# EAGLE board Spartan3E_DevBoard-v22 (EAGLE 5.00)
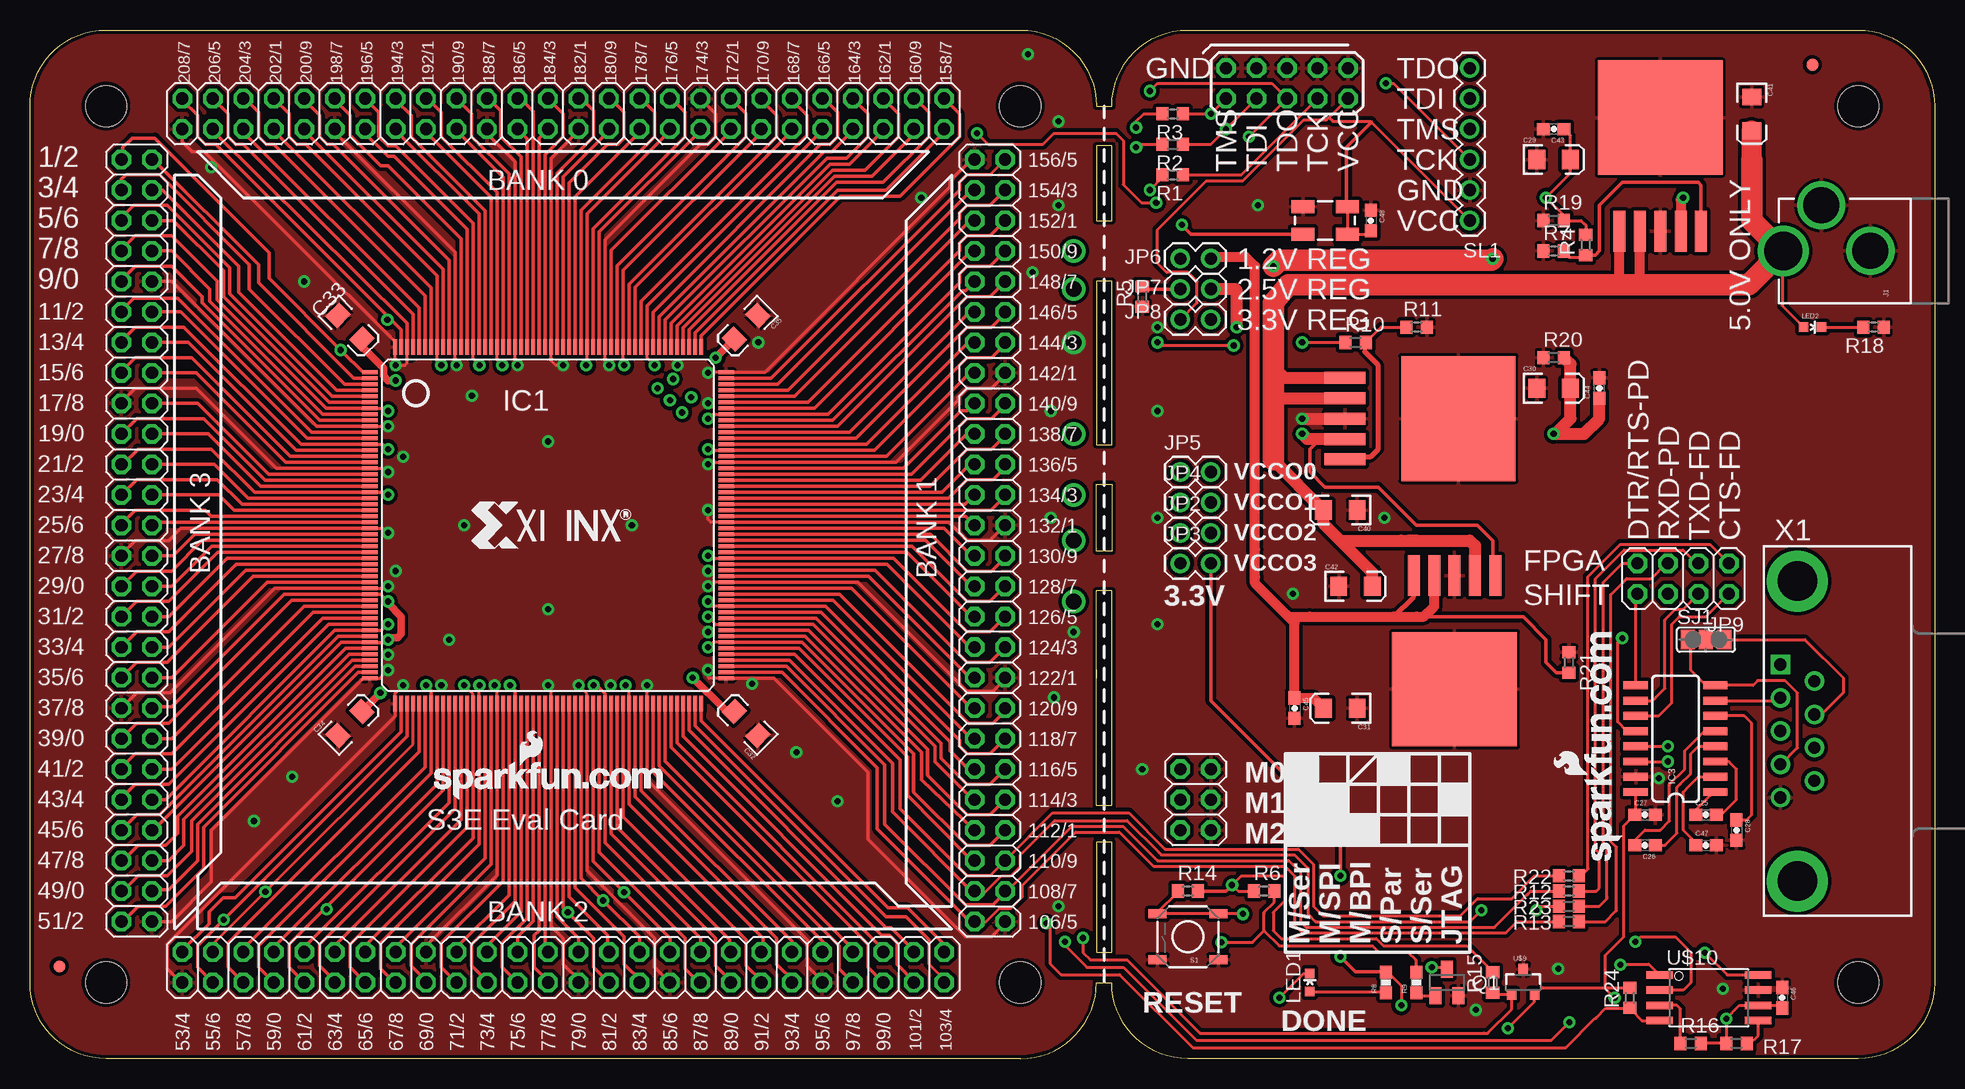
[diagram p3: board, top side]
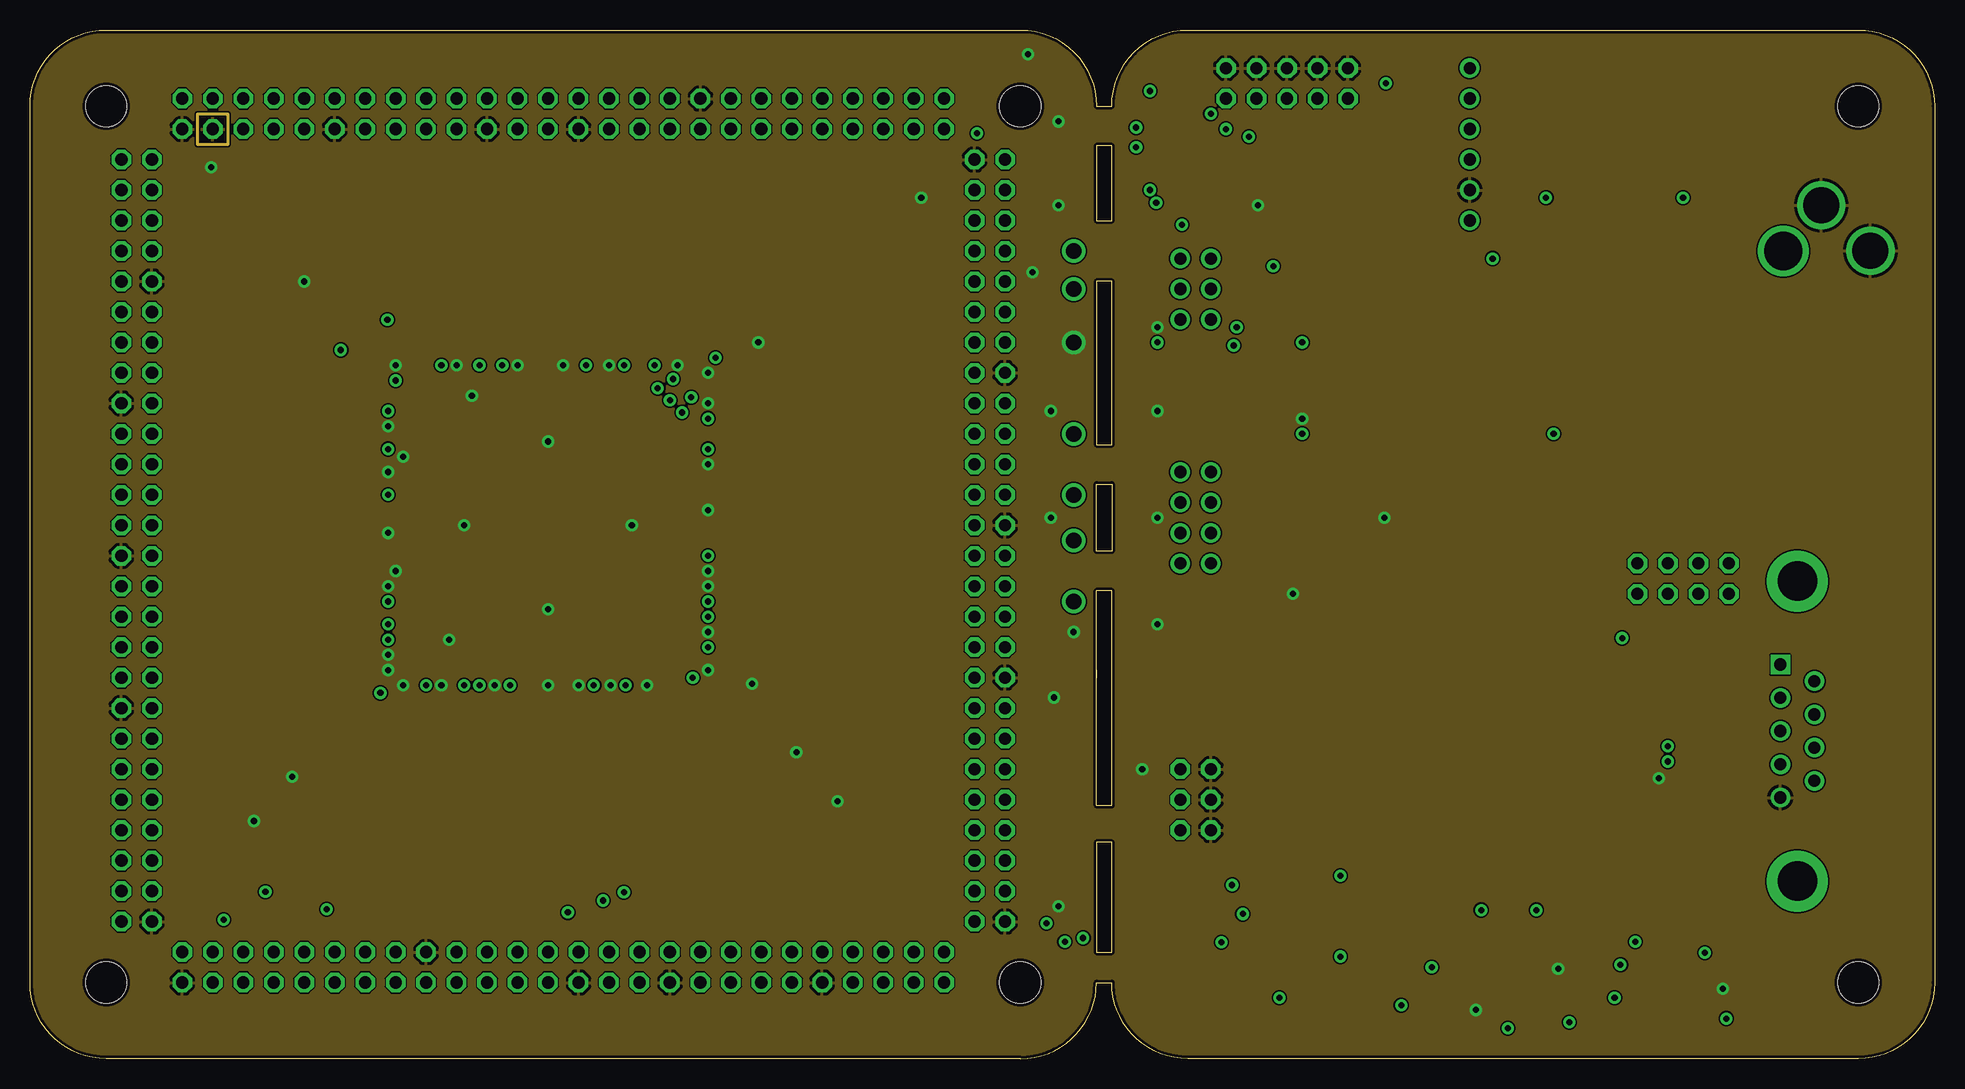
[diagram p4: board, inner layer Route2]
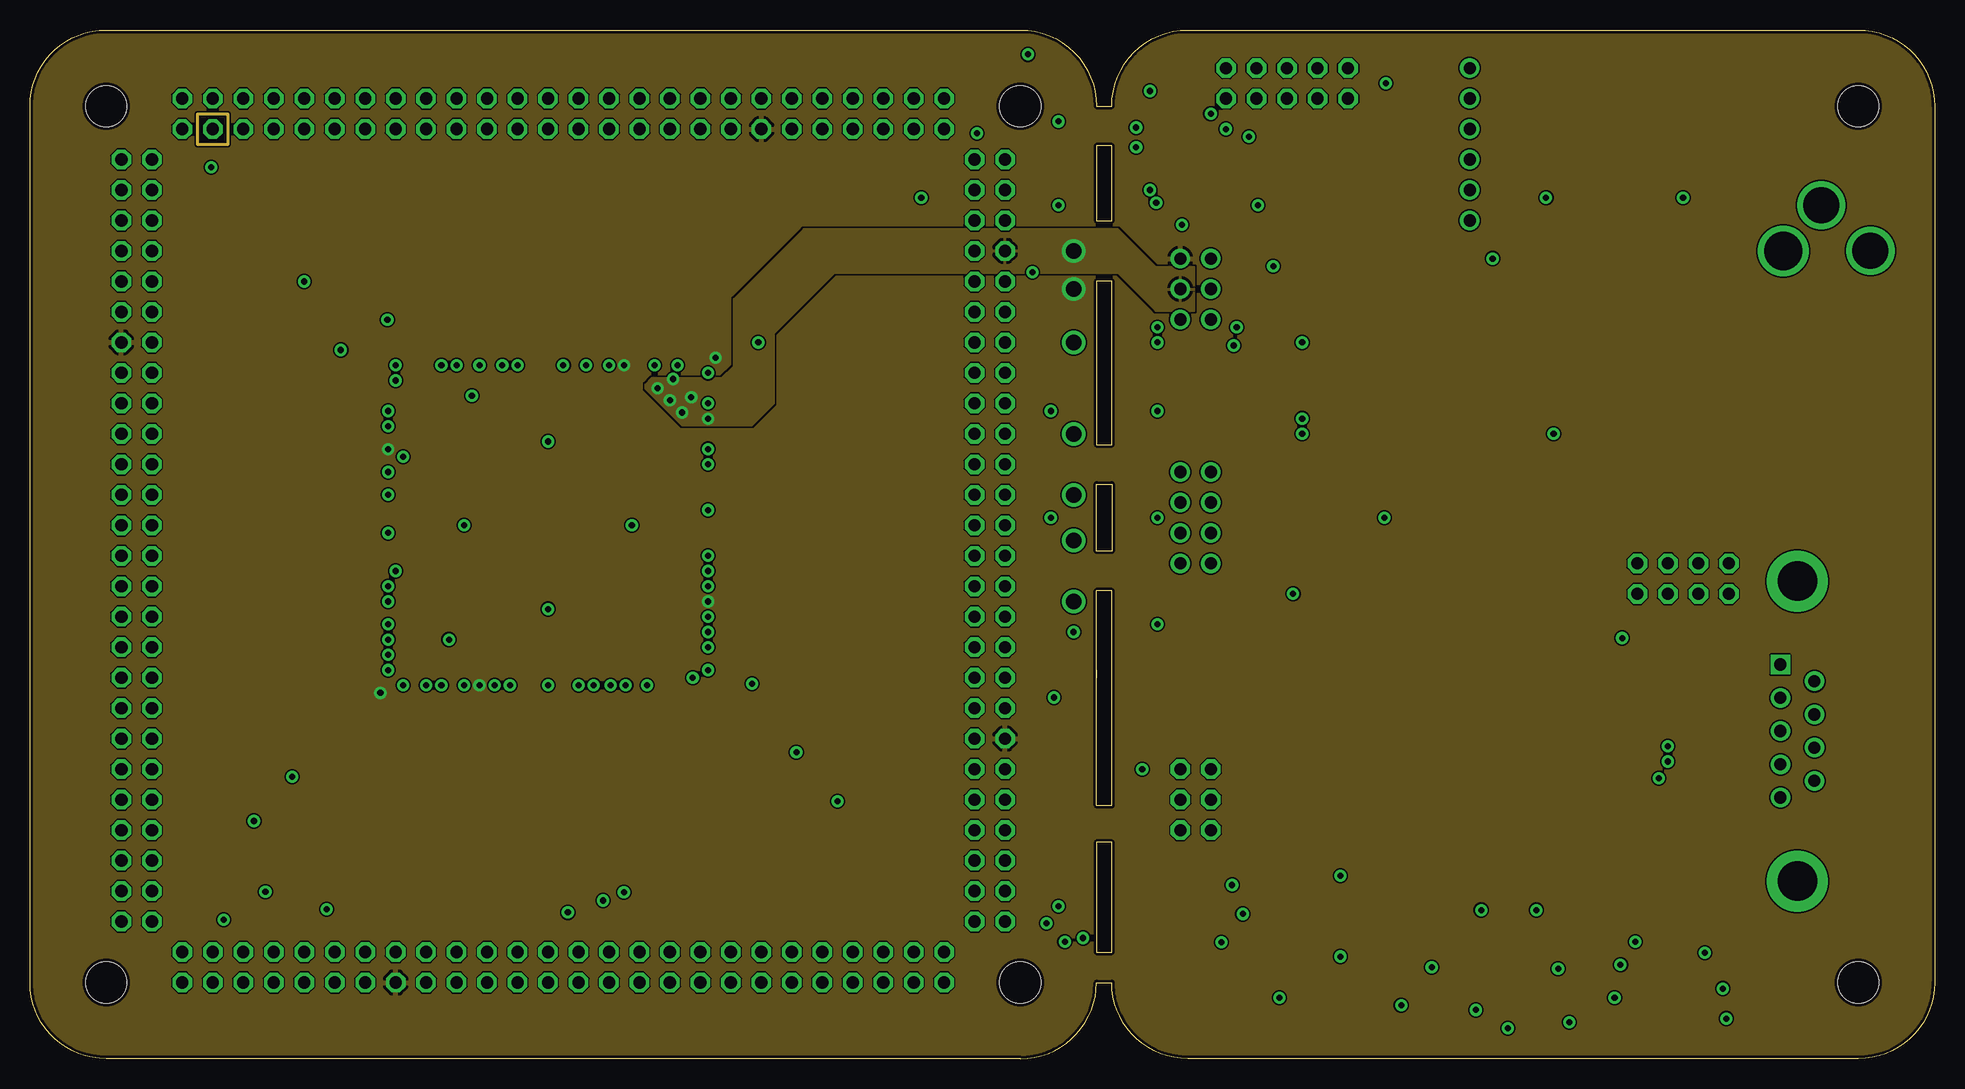
[diagram p5: board, inner layer Route3]
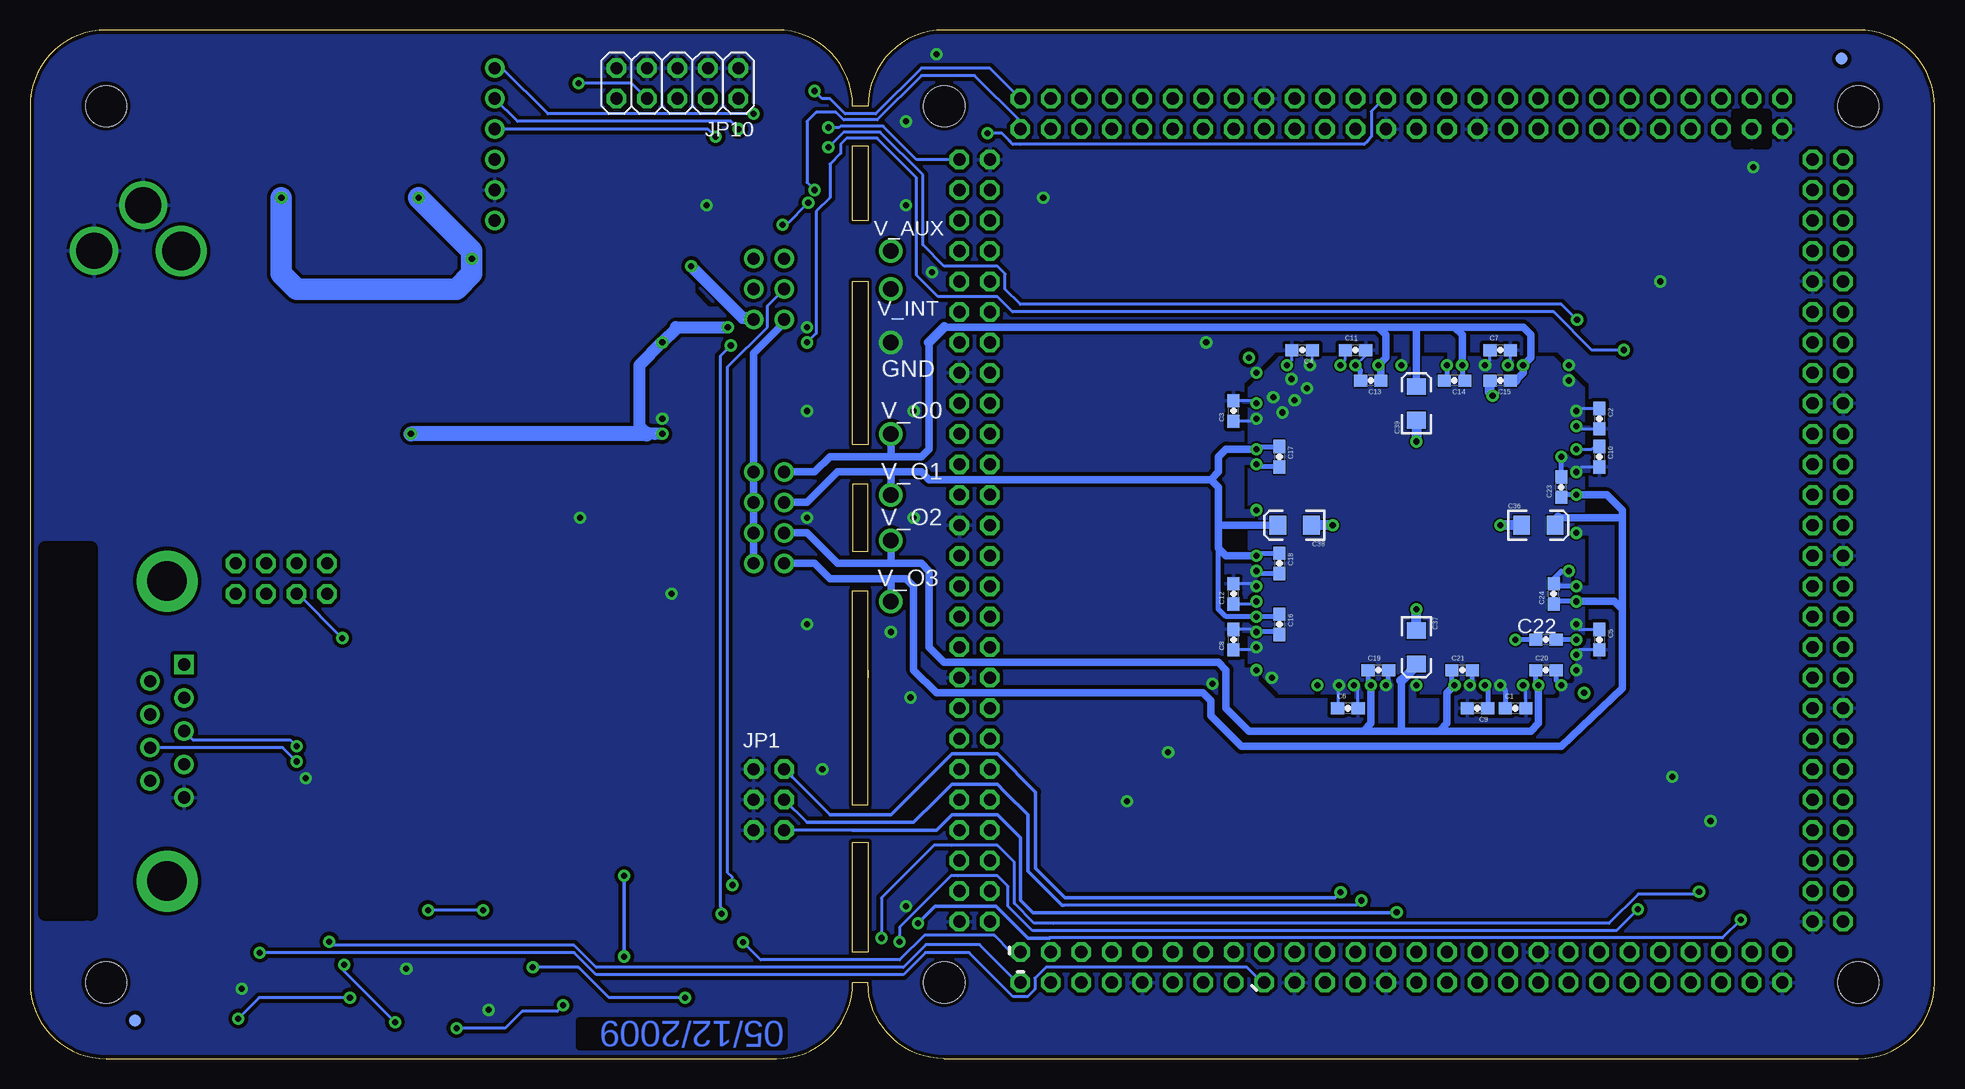
[diagram p6: board, bottom side, seen from below]

Size 158.75 x 85.72 mm. Coordinates in mm from the lower left corner, seen from the top.
Outline: 88.9,32.38 88.9,31.75
Outline: 0,6.35 0,79.38 arc-90 6.35,85.72 82.55,85.72 arc-90 88.9,79.38 90.17,79.38 arc-90 96.52,85.72 152.4,85.72 arc-90 158.75,79.38 158.75,6.35 arc-90 152.4,0 96.52,0 arc-90 90.17,6.35 88.9,6.35 arc-90 82.55,0 6.35,0 arc-90 0,6.35
Outline: 88.9,8.89 90.17,8.89 90.17,18.03 88.9,18.03 88.9,8.89
Outline: 88.9,21.11 90.17,21.11 90.17,38.99 88.9,38.99 88.9,21.11
Outline: 90.17,76.07 88.9,76.07 88.9,69.85 90.17,69.85 90.17,76.07
Outline: 90.17,64.77 88.9,64.77 88.9,51.18 90.17,51.18 90.17,64.77
Outline: 88.9,47.88 90.17,47.88 90.17,42.29 88.9,42.29 88.9,47.88
Copper layers (1*16): Top 0.0356mm / dielectric 1.5011mm / Bottom 0.0356mm
Design rules "SparkFun *": minimum track width 8mil, minimum drill 20mil, track to track 5mil, track to pad 5mil, pad to pad 5mil, via to via 5mil, smd to smd 8mil, copper to edge 10mil, drill to drill 8mil, minimum pad ring 12mil, minimum via ring 10mil, stop-mask expansion 4mil, vias tented up to drill 25mil, thermal gap 10mil
Net classes: 0 default: width 0.254 mm
Holes 3.43 mm at 6.35,6.35 152.4,6.35 152.4,79.38 6.35,79.38 82.55,6.35 82.55,79.38
tRestrict: 12 lines
bRestrict: 17 lines

## Footprints (pad centres in the part's own frame; a part is rotated, then mirrored left to right if it is on the bottom)
0603-CAP = smd 1.1 x 1: 1 -0.85,0; 2 0.85,0
EIA3216 = smd 1.4 x 1.6: A 1.4,0; C -1.4,0
PQ208 = smd 1.3 x 0.32: 1 -14.85,12.75; 2 -14.85,12.25; 3 -14.85,11.75; 4 -14.85,11.25; 5 -14.85,10.75; 6 -14.85,10.25; 7 -14.85,9.75; 8 -14.85,9.25; 9 -14.85,8.75; 10 -14.85,8.25; 11 -14.85,7.75; 12 -14.85,7.25; 13 -14.85,6.75; 14 -14.85,6.25; 15 -14.85,5.75; 16 -14.85,5.25; 17 -14.85,4.75; 18 -14.85,4.25; 19 -14.85,3.75; 20 -14.85,3.25; 21 -14.85,2.75; 22 -14.85,2.25; 23 -14.85,1.75; 24 -14.85,1.25; 25 -14.85,0.75; 26 -14.85,0.25; 27 -14.85,-0.25; 28 -14.85,-0.75; 29 -14.85,-1.25; 30 -14.85,-1.75; 31 -14.85,-2.25; 32 -14.85,-2.75; 33 -14.85,-3.25; 34 -14.85,-3.75; 35 -14.85,-4.25; 36 -14.85,-4.75; 37 -14.85,-5.25; 38 -14.85,-5.75; 39 -14.85,-6.25; 40 -14.85,-6.75; 41 -14.85,-7.25; 42 -14.85,-7.75; 43 -14.85,-8.25; 44 -14.85,-8.75; 45 -14.85,-9.25; 46 -14.85,-9.75; 47 -14.85,-10.25; 48 -14.85,-10.75; 49 -14.85,-11.25; 50 -14.85,-11.75; 51 -14.85,-12.25; 52 -14.85,-12.75; 105 14.85,-12.75; 106 14.85,-12.25; 107 14.85,-11.75; 108 14.85,-11.25; 109 14.85,-10.75; 110 14.85,-10.25; 111 14.85,-9.75; 112 14.85,-9.25; 113 14.85,-8.75; 114 14.85,-8.25; 115 14.85,-7.75; 116 14.85,-7.25; 117 14.85,-6.75; 118 14.85,-6.25; 119 14.85,-5.75; 120 14.85,-5.25; 121 14.85,-4.75; 122 14.85,-4.25; 123 14.85,-3.75; 124 14.85,-3.25; 125 14.85,-2.75; 126 14.85,-2.25; 127 14.85,-1.75; 128 14.85,-1.25; 129 14.85,-0.75; 130 14.85,-0.25; 131 14.85,0.25; 132 14.85,0.75; 133 14.85,1.25; 134 14.85,1.75; 135 14.85,2.25; 136 14.85,2.75; 137 14.85,3.25; 138 14.85,3.75; 139 14.85,4.25; 140 14.85,4.75; 141 14.85,5.25; 142 14.85,5.75; 143 14.85,6.25; 144 14.85,6.75; 145 14.85,7.25; 146 14.85,7.75; 147 14.85,8.25; 148 14.85,8.75; 149 14.85,9.25; 150 14.85,9.75; 151 14.85,10.25; 152 14.85,10.75; 153 14.85,11.25; 154 14.85,11.75; 155 14.85,12.25; 156 14.85,12.75 | smd 0.32 x 1.3: 53 -12.75,-14.85; 54 -12.25,-14.85; 55 -11.75,-14.85; 56 -11.25,-14.85; 57 -10.75,-14.85; 58 -10.25,-14.85; 59 -9.75,-14.85; 60 -9.25,-14.85; 61 -8.75,-14.85; 62 -8.25,-14.85; 63 -7.75,-14.85; 64 -7.25,-14.85; 65 -6.75,-14.85; 66 -6.25,-14.85; 67 -5.75,-14.85; 68 -5.25,-14.85; 69 -4.75,-14.85; 70 -4.25,-14.85; 71 -3.75,-14.85; 72 -3.25,-14.85; 73 -2.75,-14.85; 74 -2.25,-14.85; 75 -1.75,-14.85; 76 -1.25,-14.85; 77 -0.75,-14.85; 78 -0.25,-14.85; 79 0.25,-14.85; 80 0.75,-14.85; 81 1.25,-14.85; 82 1.75,-14.85; 83 2.25,-14.85; 84 2.75,-14.85; 85 3.25,-14.85; 86 3.75,-14.85; 87 4.25,-14.85; 88 4.75,-14.85; 89 5.25,-14.85; 90 5.75,-14.85; 91 6.25,-14.85; 92 6.75,-14.85; 93 7.25,-14.85; 94 7.75,-14.85; 95 8.25,-14.85; 96 8.75,-14.85; 97 9.25,-14.85; 98 9.75,-14.85; 99 10.25,-14.85; 100 10.75,-14.85; 101 11.25,-14.85; 102 11.75,-14.85; 103 12.25,-14.85; 104 12.75,-14.85; 157 12.75,14.85; 158 12.25,14.85; 159 11.75,14.85; 160 11.25,14.85; 161 10.75,14.85; 162 10.25,14.85; 163 9.75,14.85; 164 9.25,14.85; 165 8.75,14.85; 166 8.25,14.85; 167 7.75,14.85; 168 7.25,14.85; 169 6.75,14.85; 170 6.25,14.85; 171 5.75,14.85; 172 5.25,14.85; 173 4.75,14.85; 174 4.25,14.85; 175 3.75,14.85; 176 3.25,14.85; 177 2.75,14.85; 178 2.25,14.85; 179 1.75,14.85; 180 1.25,14.85; 181 0.75,14.85; 182 0.25,14.85; 183 -0.25,14.85; 184 -0.75,14.85; 185 -1.25,14.85; 186 -1.75,14.85; 187 -2.25,14.85; 188 -2.75,14.85; 189 -3.25,14.85; 190 -3.75,14.85; 191 -4.25,14.85; 192 -4.75,14.85; 193 -5.25,14.85; 194 -5.75,14.85; 195 -6.25,14.85; 196 -6.75,14.85; 197 -7.25,14.85; 198 -7.75,14.85; 199 -8.25,14.85; 200 -8.75,14.85; 201 -9.25,14.85; 202 -9.75,14.85; 203 -10.25,14.85; 204 -10.75,14.85; 205 -11.25,14.85; 206 -11.75,14.85; 207 -12.25,14.85; 208 -12.75,14.85
SO016 = smd 0.66 x 2.032: 1 -4.445,-3.315; 2 -3.175,-3.315; 3 -1.905,-3.315; 4 -0.635,-3.315; 5 0.635,-3.315; 6 1.905,-3.315; 7 3.175,-3.315; 8 4.445,-3.315; 9 4.445,3.315; 10 3.175,3.315; 11 1.905,3.315; 12 0.635,3.315; 13 -0.635,3.315; 14 -1.905,3.315; 15 -3.175,3.315; 16 -4.445,3.315
POWER_JACK_PTH_LOCK = drill 2.997 round: GND 0.025,6.608; GNDBREAK 3.812,10.7 | drill 3.2 round: PWR 0,13.878
2X03 = drill 1.016 octagon: 1 -2.54,-1.27; 2 -2.54,1.27; 3 0,-1.27; 4 0,1.27; 5 2.54,-1.27; 6 2.54,1.27
1X02@1 = drill 1.016 round: 1 -3.81,0; 2 -1.27,0
2X04 = drill 1.016 octagon: 1 -3.81,-1.27; 2 -3.81,1.27; 3 -1.27,-1.27; 4 -1.27,1.27; 5 1.27,-1.27; 6 1.27,1.27; 7 3.81,-1.27; 8 3.81,1.27
2X05 = drill 1.016 octagon: 1 -5.08,-1.27; 2 -5.08,1.27; 3 -2.54,-1.27; 4 -2.54,1.27; 5 0,-1.27; 6 0,1.27; 7 2.54,-1.27; 8 2.54,1.27; 9 5.08,-1.27; 10 5.08,1.27
LED-0603 = smd 0.8 x 0.8: A 0,-0.75; C 0,0.75
SOT23 = smd 1 x 1.4: 1 -0.95,-1.1; 2 0.95,-1.1; 3 0,1.1
R0603 = smd 1 x 1.1: 1 -0.85,0; 2 0.85,0
0603-RES = smd 1.1 x 1: 1 -0.85,0; 2 0.85,0
TACTILE_SWITCH_SMD = smd 1.524 x 0.762: 1 -2.54,1.905; 2 2.54,1.905; 3 -2.54,-1.905; 4 2.54,-1.905
SJ_2@1 = smd 1.168 x 1.6: 1 -1.524,0; 2 0,0; 3 1.524,0
1X06 = drill 1.016 round: 1 0,0; 2 2.54,0; 3 5.08,0; 4 7.62,0; 5 10.16,0; 6 12.7,0
FIDUCIAL-1X2 = smd 1 x 1: 1 0,0
2X26 = drill 1.016 octagon: 1 -11.43,-1.27; 2 -11.43,1.27; 3 -8.89,-1.27; 4 -8.89,1.27; 5 -6.35,-1.27; 6 -6.35,1.27; 7 -3.81,-1.27; 8 -3.81,1.27; 9 -1.27,-1.27; 10 -1.27,1.27; 11 1.27,-1.27; 12 1.27,1.27; 13 3.81,-1.27; 14 3.81,1.27; 15 6.35,-1.27; 16 6.35,1.27; 17 8.89,-1.27; 18 8.89,1.27; 19 11.43,-1.27; 20 11.43,1.27; 21 13.97,-1.27; 22 13.97,1.27; 23 16.51,-1.27; 24 16.51,1.27; 25 19.05,-1.27; 26 19.05,1.27; 27 21.59,-1.27; 28 21.59,1.27; 29 24.13,-1.27; 30 24.13,1.27; 31 26.67,-1.27; 32 26.67,1.27; 33 29.21,-1.27; 34 29.21,1.27; 35 31.75,-1.27; 36 31.75,1.27; 37 34.29,-1.27; 38 34.29,1.27; 39 36.83,-1.27; 40 36.83,1.27; 41 39.37,-1.27; 42 39.37,1.27; 43 41.91,-1.27; 44 41.91,1.27; 45 44.45,-1.27; 46 44.45,1.27; 47 46.99,-1.27; 48 46.99,1.27; 49 49.53,-1.27; 50 49.53,1.27; 51 52.07,-1.27; 52 52.07,1.27
Q5-DD_SPX29300@1 = smd 1 x 3.4: 1 -3.4,-7.875; 2 -1.7,-7.875; 3 0,-7.875; 4 1.7,-7.875; 5 3.4,-7.875 | smd 10.414 x 9.525: 6 0,1.595
SOT23-3 = smd 0.8 x 0.9: 1 -0.95,-1; 2 0.95,-1; 3 0,1.1
SO08 = smd 0.61 x 2.21: 1 -1.905,-2.616; 2 -0.635,-2.616; 3 0.635,-2.616; 4 1.905,-2.616; 5 1.905,5.616; 6 0.635,5.616; 7 -0.635,5.616; 8 -1.905,5.616
CRYSTAL-SMD-5X3 = smd 1.9 x 1.1: 1 -1.85,-1.15; 2 1.85,-1.15; 3 1.85,1.15; 4 -1.85,1.15
DB9 = drill 1.016 square: 1 -5.54,-1.42 | drill 1.016 round: 2 -2.77,-1.42; 3 0,-1.42; 4 2.77,-1.42; 5 5.54,-1.42; 6 -4.15,1.42; 7 -1.38,1.42; 8 1.38,1.42; 9 4.15,1.42 | drill 3.302 pad 5.08 round: G1 -12.5,0; G2 12.5,0

## Placement (x,y rotation side)
C1  0.1uf  [0603-CAP]  34.92,29.21 0 bottom
C2  0.1uf  [0603-CAP]  27.94,53.34 270 bottom
C3  0.1uf  [0603-CAP]  58.42,53.98 90 bottom
C4  0.1uf  [0603-CAP]  52.7,59.05 180 bottom
C5  0.1uf  [0603-CAP]  27.94,34.92 270 bottom
C6  0.1uf  [0603-CAP]  48.9,29.21 0 bottom
C7  0.1uf  [0603-CAP]  36.2,59.05 0 bottom
C8  0.1uf  [0603-CAP]  58.42,34.92 90 bottom
C9  0.1uf  [0603-CAP]  38.1,29.21 180 bottom
C10  0.1uf  [0603-CAP]  27.94,50.16 270 bottom
C11  0.1uf  [0603-CAP]  48.26,59.05 0 bottom
C12  0.1uf  [0603-CAP]  58.42,38.73 90 bottom
C13  0.1uf  [0603-CAP]  46.99,56.52 180 bottom
C14  0.1uf  [0603-CAP]  40.01,56.52 180 bottom
C15  0.1uf  [0603-CAP]  36.2,56.52 180 bottom
C16  0.1uf  [0603-CAP]  54.61,36.2 270 bottom
C17  0.1uf  [0603-CAP]  54.61,50.16 270 bottom
C18  0.1uf  [0603-CAP]  54.61,41.27 270 bottom
C19  0.1uf  [0603-CAP]  46.35,32.38 0 bottom
C20  0.1uf  [0603-CAP]  32.38,32.38 0 bottom
C21  0.1uf  [0603-CAP]  39.37,32.38 0 bottom
C22  0.1uf  [0603-CAP]  32.38,34.92 180 bottom
C23  0.1uf  [0603-CAP]  31.11,47.62 90 bottom
C24  0.1uf  [0603-CAP]  31.75,38.73 90 bottom
C25  0.1uf  [0603-CAP]  139.7,20.32 0 top
C26  0.1uf  [0603-CAP]  134.62,17.78 180 top
C27  0.1uf  [0603-CAP]  134.62,20.32 0 top
C28  0.1uf  [0603-CAP]  142.24,19.05 270 top
C29  10uf  [EIA3216]  127,74.93 0 top
C30  10uf  [EIA3216]  127,55.88 0 top
C31  10uf  [EIA3216]  109.22,29.21 180 top
C32  10uf  [EIA3216]  59.69,27.94 135 top
C33  10uf  [EIA3216]  26.67,60.96 315 top
C34  10uf  [EIA3216]  26.67,27.94 45 top
C35  10uf  [EIA3216]  59.69,60.96 225 top
C36  10uf  [EIA3216]  33.02,44.45 0 bottom
C37  10uf  [EIA3216]  43.18,34.29 270 bottom
C38  10uf  [EIA3216]  53.34,44.45 180 bottom
C39  10uf  [EIA3216]  43.18,54.61 90 bottom
C40  10uf  [EIA3216]  109.22,45.72 180 top
C41  10uf  [EIA3216]  143.51,78.74 270 top
C42  10uf  [EIA3216]  110.49,39.37 0 top
C43  0.1uf  [0603-CAP]  127,77.47 180 top
C44  0.1uf  [0603-CAP]  130.81,55.88 90 top
C45  0.1uf  [0603-CAP]  105.41,29.21 270 top
C46  0.1uf  [0603-CAP]  146.05,5.08 270 top
C47  0.1uf  [0603-CAP]  139.7,17.78 0 top
C48  0.1uf  [0603-CAP]  111.76,69.85 270 top
IC1  XC3S250/500E-PQ208  [PQ208]  43.18,44.45 0 top
IC3  MAX232SOIC16  [SO016]  137.16,26.67 90 top
J1  POWER_JACKPTH_LOCK  [POWER_JACK_PTH_LOCK]  160.02,67.31 90 top
JP1  [2X03]  97.16,21.59 270 top
JP2  PINHD1X2  [1X02@1]  99.69,43.81 0 top
JP3  PINHD1X2  [1X02@1]  99.69,41.27 0 top
JP4  PINHD1X2  [1X02@1]  99.69,46.35 0 top
JP5  PINHD1X2  [1X02@1]  99.69,48.9 0 top
JP6  PINHD1X2  [1X02@1]  99.69,66.67 0 top
JP7  PINHD1X2  [1X02@1]  99.69,64.14 0 top
JP8  PINHD1X2  [1X02@1]  99.69,61.59 0 top
JP9  [2X04]  137.79,40.01 180 top
JP10  [2X05]  104.78,81.28 180 bottom
LED1  [LED-0603]  106.68,6.35 0 top
LED2  [LED-0603]  148.59,60.96 270 top
Q1  [SOT23]  118.11,6.35 0 top
R1  68R  [R0603]  95.25,73.66 180 top
R2  68R  [R0603]  95.25,76.2 180 top
R3  68R  [R0603]  95.25,78.74 180 top
R4  1.6k  [R0603]  129.67,67.82 90 top
R5  82  [R0603]  92.71,63.5 90 top
R6  330  [R0603]  102.87,13.97 0 top
R7  1k  [R0603]  127,67.31 0 top
R8  470  [0603-RES]  113.03,6.35 90 top
R9  470  [0603-RES]  115.57,6.35 90 top
R10  1k [1%]  [R0603]  110.49,59.69 0 top
R11  1k [1%]  [R0603]  115.57,60.96 180 top
R12  1k  [R0603]  128.27,13.97 0 top
R13  1k  [R0603]  128.27,11.43 0 top
R14  4.7k  [R0603]  96.52,13.97 0 top
R15  4.7k  [R0603]  121.92,6.35 90 top
R16  4.7k  [R0603]  138.43,1.27 0 top
R17  4.7k  [R0603]  142.24,1.27 180 top
R18  470  [R0603]  153.67,60.96 180 top
R19  1k  [R0603]  127,69.85 0 top
R20  1k  [R0603]  127,58.42 0 top
R21  470  [R0603]  128.27,33.02 270 top
R22  1k  [R0603]  128.27,15.24 0 top
R23  1k  [R0603]  128.27,12.7 0 top
R24  4.7k  [R0603]  133.35,5.08 90 top
S1  [TACTILE_SWITCH_SMD]  96.52,10.16 180 top
SJ1  [SJ_2@1]  139.7,34.92 0 top
SL1  [1X06]  120.02,69.85 90 top
U$1  FIDUCIAL1X2  [FIDUCIAL-1X2]  148.56,82.83 0 top
U$2  PINHD-2X26  [2X26]  8.89,63.5 270 top
U$3  FIDUCIAL1X2  [FIDUCIAL-1X2]  2.44,7.7 0 top
U$4  PINHD-2X26  [2X26]  24.13,7.62 0 top
U$5  PINHD-2X26  [2X26]  80.01,22.86 90 top
U$6  PINHD-2X26  [2X26]  64.77,78.74 180 top
U$7  SPX29302  [Q5-DD_SPX29300@1]  117.47,53.34 270 top
U$8  SPX29302  [Q5-DD_SPX29300@1]  135.89,76.83 0 top
U$9  MCP130SOT  [SOT23-3]  124.46,6.35 0 top
U$10  AT45DB  [SO08]  138.43,5.08 270 top
U$11  [SFE-NEW-LOGO-WEBONLY]  33.66,21.59 0 top
U$12  3X5SMDOSC  [CRYSTAL-SMD-5X3]  107.95,69.85 180 top
U$13  [SFE-NEW-LOGO-WEBONLY]  132.72,16.51 90 top
U$14  SPX29302  [Q5-DD_SPX29300@1]  118.75,32.38 180 top
U$15  FIDUCIAL1X2  [FIDUCIAL-1X2]  7.75,83.34 0 bottom
U$16  FIDUCIAL1X2  [FIDUCIAL-1X2]  149.99,3.2 0 bottom
X1  [DB9]  147.32,27.3 270 top

## Tracks (layer width: path | path; a pad name or v marks a point on that pad's centre or on a via)
2
  Top 0.305: IC1.2 26.99,56.7 19.05,64.64 19.05,66.17 10.16,75.06 U$2.2
3
  Top 0.305: IC1.3 26.22,56.2 18.29,64.14 18.29,66.17 10.79,73.66 8,73.66 7.62,73.28 7.62,72.52 7.49,72.39 U$2.3
4
  Top 0.305: U$2.4 11.05,72.39 17.4,66.04 17.4,63.88 25.58,55.7 IC1.4
5
  Top 0.305: IC1.5 25.19,55.2 16.64,63.75 16.64,65.91 11.43,71.12 8.64,71.12 7.37,69.85 U$2.5
6
  Top 0.305: U$2.6 11.94,69.85 16.13,65.66 16.13,63.5 24.93,54.7 IC1.6
8
  Top 0.305: IC1.8 24.41,53.7 14.99,63.12 14.99,64.14 11.81,67.31 U$2.8
9
  Top 0.305: IC1.9 24.14,53.2 14.35,62.99 14.35,63.5 11.81,66.04 8.76,66.04 7.49,64.77 U$2.9
11
  Top 0.305: IC1.11 23.49,52.2 12.32,63.37 8.64,63.37 7.49,62.23 U$2.11
12
  Top 0.305: IC1.12 23.1,51.7 12.57,62.23 10.29,62.23 10.16,62.36 U$2.12
14
  Top 0.305: IC1.14 22.2,50.7 13.21,59.69 10.41,59.69 10.16,59.94 U$2.14
15
  Top 0.305: IC1.15 21.68,50.2 13.46,58.42 8.76,58.42 7.49,57.15 U$2.15
16
  Top 0.305: IC1.16 21.29,49.7 13.84,57.15 U$2.16 10.03,57.28
18
  Top 0.305: IC1.18 19.88,48.7 13.97,54.61 U$2.18
19
  Top 0.305: IC1.19 19.62,48.2 14.48,53.34 8.89,53.34 U$2.19
20
  Top 0.305: IC1.20 19.23,47.7 14.86,52.07 10.29,52.07 10.16,52.2 U$2.20
22
  Top 0.305: IC1.22 18.2,46.7 15.37,49.53 U$2.22
23
  Top 0.305: IC1.23 17.68,46.2 15.62,48.26 8.89,48.26 U$2.23
24
  Top 0.305: IC1.24 17.04,45.7 15.75,46.99 U$2.24
25
  Top 0.305: IC1.25 15.12,45.2 14.61,45.72 8.76,45.72 7.62,44.58 U$2.25
26
  Top 0.305: IC1.26 10.41,44.7 U$2.26
28
  Top 0.305: IC1.28 13.73,43.7 11.94,41.91 10.41,41.91 10.29,42.04 U$2.28
29
  Top 0.305: IC1.29 14.37,43.2 11.81,40.64 8.89,40.64 U$2.29
30
  Top 0.305: IC1.30 15.14,42.7 11.81,39.37 U$2.30 10.03,39.24
31
  Top 0.305: IC1.31 15.66,42.2 11.56,38.1 8.89,38.1 U$2.31
32
  Top 0.305: IC1.32 16.43,41.7 11.56,36.83 U$2.32 10.03,36.83
33
  Top 0.305: IC1.33 17.2,41.2 11.56,35.56 8.89,35.56 U$2.33
34
  Top 0.305: IC1.34 17.97,40.7 11.56,34.29 U$2.34 10.03,34.29
35
  Top 0.305: IC1.35 18.61,40.2 11.43,33.02 8.89,33.02 U$2.35
36
  Top 0.305: IC1.36 19.76,39.7 11.81,31.75 10.29,31.75 10.16,31.62 U$2.36
39
  Top 0.305: IC1.39 21.82,38.2 11.56,27.94 8.89,27.94 U$2.39
40
  Top 0.305: IC1.40 22.84,37.7 11.81,26.67 U$2.40 10.03,26.67
41
  Top 0.305: IC1.41 23.61,37.2 11.81,25.4 8.76,25.4 7.62,24.26 U$2.41
42
  Top 0.305: IC1.42 24.38,36.7 11.81,24.13 U$2.42 10.03,24.13
43
  Top 0.305: IC1.43 24.9,36.2 11.56,22.86 8.76,22.86 7.62,21.72 U$2.43
45
  Top 0.305: IC1.45 25.68,35.2 10.79,20.32 8.89,20.32 U$2.45 7.49,18.92
47
  Top 0.305: IC1.47 26.33,34.2 12.32,20.19 12.32,18.8 11.3,17.78 9.02,17.78 7.62,16.38 U$2.47
48
  Top 0.305: IC1.48 26.59,33.7 12.83,19.94 12.83,17.78 11.56,16.51 10.29,16.51 10.16,16.38 U$2.48
49
  Top 0.305: IC1.49 26.85,33.2 13.46,19.81 13.46,17.27 11.43,15.24 9.02,15.24 7.62,13.84 U$2.49
50
  Top 0.305: IC1.50 27.11,32.7 13.97,19.56 13.97,16.51 11.56,14.1 10.29,14.1 U$2.50 10.03,13.84
51
  Top 0.305: IC1.51 27.37,32.2 14.48,19.3 14.48,15.88 11.3,12.7 9.02,12.7 7.62,11.3 U$2.51
54
  Top 0.305: U$4.2 12.7,9.02 14.94,11.25 14.94,12.24 16.1,13.41 17.09,13.41 30.93,27.25 IC1.54
55  (via drill 0.51)
  Top 0.254: v84.73,11.28 85.04,10.97 85.04,7.92 85.95,7.01 90.83,7.01 96.93,0.91 128.02,0.91 130.45,3.35 130.48,3.35 130.56,3.43 131.32,4.19 133.35,4.19 | 133.35,4.19 R24.1 133.35,4.19 | 133.35,4.19 133.35,4.13 | 133.35,4.19 133.48,4.06 134.37,3.17 U$10.4
  Top 0.305: IC1.55 31.43,26.86 v16.15,11.58 13.97,9.4 13.97,7.62 U$4.3 15.37,6.22
  Bottom 0.254: 73.76,10.06 17.68,10.06 v16.15,11.58
  Bottom 0.305: v84.73,11.28 83.31,12.7 81.28,12.7 78.23,12.7 75.69,10.16 75.56,10.03 73.91,10.03 73.79,10.03 73.76,10.06
56  (via drill 0.51)
  Top 0.254: IC1.56 31.93,26.21 v19.62,13.91 15.24,9.53 U$4.4 | v87.78,10.06 87.78,8.84 88.39,8.23 91.44,8.23 97.54,2.13 121.21,2.13 121.51,2.13 121.54,2.16 123.51,4.13 U$9.1 121.9,5.35 121.79,5.46 121.83,5.5 R15.1
  Bottom 0.254: v87.78,10.06 87.78,13.41 83.41,17.78 81.92,17.78 78.11,17.78 76.71,16.38 76.71,12.95 75.06,11.3 73.53,11.3 73.48,11.3 73.46,11.28 27.13,11.28 24.69,13.72 19.81,13.72 v19.62,13.91 19.51,14.02
57
  Top 0.305: IC1.57 32.43,25.57 16.51,9.65 16.51,7.62 U$4.5 17.91,6.22
58
  Top 0.305: IC1.58 32.93,24.29 18.03,9.4 18.03,9.14 U$4.6
60
  Top 0.305: 20.45,8.76 U$4.8 20.32,9.27 33.93,22.88 IC1.60
61  (via drill 0.51)
  Top 0.254: v128.32,3.05 126.8,1.52 97.23,1.52 91.14,7.62 88.09,7.62 86.26,9.45 v86.26,9.75 | 24.62,12.56 v24.74,12.45 | v132.57,7.83 132.59,7.84 132.59,7.87 134.93,7.87 U$10.1
  Top 0.305: IC1.61 34.43,22.36 24.62,12.56 21.59,9.53 21.59,7.62 U$4.9 22.99,6.22
  Bottom 0.254: v128.32,3.05 131.67,6.4 132.59,7.32 132.59,7.87 132.59,7.84 v132.57,7.83 | v86.26,9.75 86.26,10.97 84.28,12.95 81.99,15.24 81.41,15.24 78.11,15.24 77.22,14.35 77.22,12.7 75.18,10.67 73.79,10.67 73.66,10.67 26.52,10.67 v24.74,12.45
62
  Top 0.305: 22.99,8.76 U$4.10 23.11,9.14 23.11,9.53 34.93,21.34 IC1.62
63
  Top 0.305: IC1.63 35.43,20.82 24.13,9.53 24.13,7.75 25.53,6.35 U$4.11
64
  Top 0.305: U$4.12 25.4,9.14 25.27,9.27 35.93,19.93 IC1.64
65
  Top 0.305: IC1.65 36.43,19.29 26.67,9.53 26.67,7.62 U$4.13 28.07,6.22
68
  Top 0.305: U$4.16 30.48,9.27 37.93,16.72 IC1.68
69
  Top 0.305: 33.15,6.22 U$4.17 33.15,6.35 31.75,7.75 31.75,9.53 38.43,16.2 IC1.69
71
  Top 0.305: IC1.71 39.43,14.79 34.29,9.65 34.29,7.62 U$4.19
72
  Top 0.305: U$4.20 35.43,8.89 35.31,9.02 39.93,13.64 IC1.72
74
  Top 0.305: 38.23,8.76 U$4.22 38.1,9.4 40.93,12.23 IC1.74
75
  Top 0.305: IC1.75 41.43,11.71 39.37,9.65 39.37,7.62 U$4.23
76
  Top 0.305: 40.77,8.76 U$4.24 40.77,8.89 40.64,9.02 40.64,10.16 41.93,11.45 IC1.76
77
  Top 0.305: IC1.77 42.43,10.68 42.04,10.29 42.04,7.62 43.18,6.48 U$4.25
78
  Top 0.305: IC1.78 42.93,9.14 U$4.26
80
  Top 0.305: IC1.80 43.93,11.82 45.72,10.03 U$4.28 45.85,8.76
81  (via drill 0.51)
  Top 0.305: IC1.81 44.43,12.59 v44.83,12.19 46.99,10.03 46.99,7.62 U$4.29
  Bottom 0.254: 90.17,19.05 95.25,19.05 JP1.5
  Bottom 0.305: v44.83,12.19 44.81,12.17 72.97,12.17 75.16,12.17 76.2,13.21 76.2,18.41 78.11,20.32 78.23,20.32 81.92,20.32 83.19,19.05 90.17,19.05
82
  Top 0.305: IC1.82 44.93,13.49 48.13,10.29 48.13,8.76 48.26,8.64 U$4.30
83
  Top 0.305: IC1.83 45.43,14.26 49.53,10.16 49.53,7.87 50.93,6.48 U$4.31
84  (via drill 0.51)
  Top 0.305: IC1.84 45.93,15.03 v47.78,13.18 50.8,10.16 U$4.32
  Bottom 0.254: 72.54,12.8 48.16,12.8 v47.78,13.18 | 93.98,19.68 JP1.3
  Bottom 0.305: 72.54,12.8 72.75,12.8 72.77,12.83 75.56,15.62 75.56,17.53 75.56,20.32 77.47,22.23 78.11,22.86 81.92,22.86 83.19,21.59 85.09,19.68 87.38,19.68 93.98,19.68
86  (via drill 0.51)
  Top 0.305: IC1.86 46.93,16.44 v49.51,13.87 53.34,10.03 U$4.34
  Bottom 0.254: 49.66,13.72 49.68,13.72 | 92.08,20.32 95.25,23.5 95.25,24.13 JP1.1
  Bottom 0.305: v49.51,13.87 49.66,13.72 | 49.68,13.72 49.99,13.41 72.24,13.41 72.47,13.41 74.93,15.88 74.93,22.23 78.11,25.4 81.92,25.4 87,20.32 92.08,20.32
87  (via drill 0.51)
  Top 0.254: v139.6,8.84 139.62,8.84 139.7,8.76 141.48,6.99 U$10.8
  Top 0.305: IC1.87 47.43,17.21 54.61,10.03 54.61,7.49 55.88,6.22 U$4.35
  Bottom 0.254: U$4.35 56.03,6.35 57.3,7.62 74.07,7.62 74.98,6.71 74.98,5.79 75.59,5.18 76.81,5.18 80.47,8.84 84.12,8.84 85.95,7.01 111.56,7.01 113.39,8.84 v139.6,8.84
89
  Top 0.305: IC1.89 48.43,18.75 57.15,10.03 57.15,7.75 58.55,6.35 | 58.55,6.35 58.67,6.22 | U$4.37 58.55,6.35
90
  Top 0.305: IC1.90 48.93,19.27 58.29,9.91 58.29,8.76 U$4.38
91
  Top 0.305: IC1.91 49.43,20.17 59.69,9.91 59.69,7.75 60.96,6.48 U$4.39
93
  Top 0.305: IC1.93 50.43,21.83 62.23,10.03 62.23,7.87 63.63,6.48 U$4.41
94
  Top 0.305: IC1.94 50.93,22.35 63.5,9.78 U$4.42 63.63,8.76
96
  Top 0.305: IC1.96 51.93,23.89 66.17,9.65 66.17,8.76 U$4.44
97
  Top 0.305: IC1.97 52.43,24.41 67.44,9.4 67.44,7.49 U$4.45
98
  Top 0.305: U$4.46 68.58,9.14 52.93,24.79 IC1.98
99
  Top 0.305: IC1.99 53.43,25.95 69.85,9.53 69.85,7.62 U$4.47 71.25,6.22
100
  Top 0.305: U$4.48 71.37,8.89 53.93,26.33 IC1.100
101
  Top 0.305: IC1.101 54.43,26.85 70.99,10.29 71.63,10.29 72.26,9.65 72.26,7.87 73.79,6.35 U$4.49
102
  Top 0.305: IC1.102 54.93,27.37 71.37,10.92 71.75,10.92 73.66,9.02 U$4.50
103  (via drill 0.51)
  Top 0.254: 74.93,8 74.93,7.87 76.2,6.6 U$4.51 | U$10.2 137.79,5.71 138.43,6.35 138.43,8.89 137.16,10.16 134.24,10.16 133.86,9.78 133.83,9.75 v133.81,9.75
  Top 0.305: IC1.103 55.43,27.75 71.37,11.81 73.03,11.81 74.93,9.91 74.93,8
  Bottom 0.254: U$4.51 76.45,6.35 79.6,9.5 84.07,9.5 85.95,7.62 111.56,7.62 113.39,9.45 133.5,9.45 v133.81,9.75
106
  Top 0.254: U$5.2 79.69,11.43 80.8,12.54 81.76,12.54 82.71,13.49 82.71,14.43 87.17,18.89 90.81,18.89 93.66,16.03 104.62,16.03 105.41,15.24 105.41,11.11 106.05,10.48 122.87,10.48 123,10.48 123.06,10.54 123.95,11.43 R13.1
  Top 0.305: IC1.106 62.67,32.2 70.61,24.26 70.61,19.18 78.61,11.18 78.74,11.3 U$5.2
107
  Top 0.254: 81.41,13.97 81.44,13.97 86.84,19.37 91.12,19.37 93.98,16.51 104.93,16.51 105.89,15.56 105.89,11.43 106.36,10.95 122.08,10.95 124.78,13.65 124.84,13.72 125.09,13.97 R12.1
  Top 0.305: IC1.107 63.06,32.7 71.25,24.51 71.25,19.56 77.98,12.83 80.26,12.83 81.41,13.97 U$5.3
108  (via drill 0.51)
  Top 0.254: 94.14,17.14 91.44,19.84 85.41,19.84 82.55,16.99 82.55,16.03 81.76,15.24 80.96,15.24 79.44,13.72 78.74,13.72 | 94.14,17.14 | 94.14,17.14 94.3,16.99 105.41,16.99 106.52,15.88 106.52,12.06 107.16,11.43 120.02,11.43 v120.97,12.38 | v125.57,12.38 125.57,12.41 125.6,12.45 125.86,12.7 R23.1
  Top 0.305: IC1.108 63.32,33.2 71.88,24.64 71.88,20.57 78.74,13.72 U$5.4
  Bottom 0.254: v120.97,12.38 v125.57,12.38
109
  Top 0.254: 80.01,15.24 U$5.5 85.25,20.48 91.6,20.48 94.61,17.46 105.73,17.46 107,16.19 107,12.7 107.79,11.91 119.22,11.91 120.65,13.34 123.51,13.34 125.41,15.24 R22.1
  Top 0.305: IC1.109 63.71,33.7 72.52,24.89 72.52,20.83 78.11,15.24 80.01,15.24
110
  Top 0.305: IC1.110 64.1,34.2 73.15,25.15 73.15,21.97 77.98,17.02 78.61,16.38 78.74,16.38 U$5.6
112
  Top 0.305: IC1.112 64.62,35.2 74.3,25.53 74.3,23.24 U$5.8
113
  Top 0.305: IC1.113 64.88,35.7 74.8,25.78 74.8,23.62 78.11,20.32 80.01,20.32 U$5.9
115
  Top 0.305: IC1.115 65.53,36.7 75.95,26.29 75.95,25.02 78.11,22.86 80.01,22.86 U$5.11 81.41,24.26
116
  Top 0.305: IC1.116 65.92,37.2 76.71,26.42 76.71,25.65 78.23,24.13 U$5.12
118
  Top 0.305: U$5.14 78.49,26.67 66.96,38.2 IC1.118
119
  Top 0.305: IC1.119 67.47,38.7 78.23,27.94 80.26,27.94 81.53,29.21 U$5.15
120
  Top 0.305: U$5.16 78.49,29.21 68.5,39.2 IC1.120
122
  Top 0.305: U$5.18 78.36,31.75 69.91,40.2 IC1.122
123
  Top 0.305: IC1.123 70.42,40.7 78.11,33.02 80.01,33.02 U$5.19 81.41,34.42
124
  Top 0.305: U$5.20 78.36,34.29 71.45,41.2 IC1.124
126
  Top 0.305: U$5.22 78.49,36.83 73.12,42.2 IC1.126
127
  Top 0.305: IC1.127 73.5,42.7 78.11,38.1 80.01,38.1 U$5.23
128
  Top 0.305: IC1.128 74.66,43.2 78.23,39.62 78.49,39.62 U$5.24 78.87,39.24
129
  Top 0.305: IC1.129 75.05,43.7 78.11,40.64 80.14,40.64 81.41,41.91 U$5.25
130
  Top 0.305: U$5.26 78.49,41.91 76.2,44.2 IC1.130
132
  Top 0.305: 78.74,44.42 78.84,44.32 | 78.74,44.42 U$5.28 | IC1.132 77.97,45.2 78.74,44.42
133
  Top 0.305: U$5.29 81.41,46.99 80.12,45.7 IC1.133
134
  Top 0.305: IC1.134 77.95,46.2 U$5.30
135
  Top 0.305: IC1.135 76.55,46.7 78.11,48.26 80.26,48.26 81.41,49.4 U$5.31
136
  Top 0.305: U$5.32 78.36,49.53 76.03,47.2 IC1.136
137
  Top 0.305: IC1.137 75,47.7 78.11,50.8 80.14,50.8 81.41,52.07 U$5.33
138
  Top 0.305: IC1.138 74.23,48.2 78.11,52.07 U$5.34 78.87,52.07
139
  Top 0.305: IC1.139 73.47,48.7 78.11,53.34 80.14,53.34 81.41,54.61 U$5.35
140
  Top 0.305: IC1.140 72.82,49.2 77.6,53.98 78.11,53.98 U$5.36 78.87,54.74
142
  Top 0.305: U$5.38 78.74,57.28 78.61,57.4 71.41,50.2 IC1.142
144
  Top 0.305: U$5.40 78.23,59.69 69.74,51.2 IC1.144
145
  Top 0.305: IC1.145 68.84,51.7 78.11,60.96 80.14,60.96 81.41,62.23 U$5.41
146
  Top 0.305: IC1.146 68.33,52.2 78.23,62.1 78.61,62.1 U$5.42
147
  Top 0.305: IC1.147 67.31,52.7 78.11,63.5 80.01,63.5 U$5.43 81.41,64.9
148
  Top 0.305: IC1.148 66.92,53.2 77.72,64.01 77.98,64.01 U$5.44 78.87,64.9
150
  Top 0.305: U$5.46 78.49,67.31 65.38,54.2 IC1.150
151
  Top 0.305: IC1.151 64.86,54.7 77.47,67.31 77.47,67.94 78.11,68.58 80.01,68.58 U$5.47
152
  Top 0.305: U$5.48 78.36,69.85 63.71,55.2 IC1.152
153
  Top 0.305: IC1.153 63.19,55.7 77.47,69.98 77.47,70.48 78.11,71.12 80.01,71.12 U$5.49
154
  Top 0.305: U$5.50 78.49,72.39 62.3,56.2 IC1.154
159
  Top 0.305: IC1.159 54.93,60.75 67.21,73.03 71.12,73.03 74.93,76.83 74.93,78.87 73.79,80.01 U$6.3
160
  Top 0.305: IC1.160 54.43,60.91 67.06,73.53 70.18,73.53 73.66,77.01 U$6.4
161
  Top 0.305: IC1.161 53.93,61.07 66.9,74.04 69.6,74.04 72.39,76.83 72.39,78.74 U$6.5
162
  Top 0.305: IC1.162 53.43,61.3 66.67,74.55 68.33,74.55 71.12,77.34 U$6.6
163
  Top 0.305: IC1.163 52.93,61.57 66.42,75.06 68.07,75.06 69.85,76.83 69.85,78.74 U$6.7
164
  Top 0.305: IC1.164 52.43,61.83 66.17,75.56 66.8,75.56 68.58,77.34 U$6.8
165
  Top 0.305: IC1.165 51.93,62.22 65.91,76.2 66.67,76.2 67.31,76.83 67.31,78.87 66.04,80.14 U$6.9
167
  Top 0.305: IC1.167 50.93,63.12 64.77,76.96 64.77,78.61 63.37,80.01 U$6.11
168
  Top 0.305: U$6.12 63.5,77.34 50.43,64.27 IC1.168
169
  Top 0.305: IC1.169 49.93,64.53 62.23,76.83 62.23,78.61 60.83,80.01 U$6.13
171
  Top 0.305: IC1.171 48.93,66.08 59.69,76.83 59.69,78.74 U$6.15
172
  Top 0.305: U$6.16 58.42,77.34 48.43,67.35 IC1.172
174
  Top 0.305: U$6.18 55.88,77.34 47.43,68.89 IC1.174
175
  Top 0.305: IC1.175 46.93,69.16 54.61,76.83 54.61,78.87 53.34,80.14 U$6.19
177
  Top 0.305: IC1.177 45.93,70.69 52.07,76.83 52.07,78.87 50.8,80.14 U$6.21
178
  Top 0.305: U$6.22 50.93,77.34 45.43,71.85 IC1.178
179
  Top 0.305: IC1.179 44.93,73 48.13,76.2 49.02,76.2 49.53,76.71 49.53,78.87 48.39,80.01 U$6.23
180
  Top 0.305: U$6.24 48.26,77.34 44.43,73.51 IC1.180
181  (via drill 0.51)
  Top 0.254: v93.88,71.32 92.66,71.32 91.14,72.85 91.14,76.5 90.53,77.11 85.34,77.11 84.43,76.2 79.86,76.2 v78.94,77.11
  Top 0.305: IC1.181 43.93,73.78 46.99,76.83 46.99,78.99 45.85,80.14 U$6.25 | v96.01,69.49 96.01,69.47 96.78,68.7 U$12.3
  Bottom 0.254: v96.01,69.49 95.71,69.49 v93.88,71.32 | v78.94,77.11 77.72,77.11 77.11,76.5 77.11,76.48 76.96,76.33 76.83,76.2 76.2,76.2 47.55,76.2 47.24,76.5 46.94,76.81 46.94,78.94 45.87,80.01 U$6.25
183
  Top 0.305: IC1.183 42.93,75.31 44.45,76.83 44.45,78.74 U$6.27 43.05,80.14
184
  Top 0.305: IC1.184 42.43,76.72 U$6.28
185
  Top 0.305: U$6.29 40.77,80.14 41.93,78.97 IC1.185
186
  Top 0.305: IC1.186 41.43,76.68 U$6.30
187
  Top 0.305: IC1.187 40.93,75.15 39.24,76.83 39.24,78.99 38.23,80.01 U$6.31
189
  Top 0.305: IC1.189 39.93,73.73 36.83,76.83 36.83,78.74 U$6.33
190
  Top 0.305: U$6.34 35.43,77.47 39.43,73.47 IC1.190
192
  Top 0.305: U$6.36 33.02,77.22 38.43,71.81 IC1.192
193
  Top 0.305: IC1.193 37.93,70.66 31.75,76.83 31.75,78.61 30.48,79.88 U$6.37
194
  Top 0.305: U$6.38 30.35,77.47 37.43,70.39 IC1.194
196
  Top 0.305: IC1.196 36.43,69.11 30.35,75.18 29.84,75.18 27.69,77.34 27.81,77.47 U$6.40
197
  Top 0.305: IC1.197 35.93,68.34 29.84,74.42 29.21,74.42 26.67,76.96 26.67,78.61 25.27,80.01 U$6.41
199
  Top 0.305: IC1.199 34.93,66.54 25.27,76.2 24.77,76.2 24.13,76.83 24.13,78.61 22.73,80.01 U$6.43
200
  Top 0.305: U$6.44 22.73,77.47 34.43,65.77 IC1.200
202
  Top 0.305: U$6.46 20.32,77.34 33.43,64.23 IC1.202
203
  Top 0.305: IC1.203 32.93,63.59 20.32,76.2 19.68,76.2 19.05,76.83 19.05,78.87 17.78,80.14 U$6.47
204
  Top 0.305: U$6.48 17.65,77.34 32.43,62.57 IC1.204
205
  Top 0.305: IC1.205 31.93,62.05 17.78,76.2 17.14,76.2 16.51,76.83 16.51,78.74 U$6.49 15.11,80.14
CTS
  Top 0.254: JP9.2 139.7,36.83 137.48,36.83 136.84,36.2 136.84,29.84 136.84,29.65 136.78,29.59 135.76,28.57 IC3.11
CTS_I  (via drill 0.51)
  Top 0.254: IC3.14 v136.53,24.77
  Bottom 0.254: X1.8 137.69,25.93 v136.53,24.77
DONE  (via drill 0.51)
  Top 0.254: 102.87,10.67 102.87,12.06 102.87,12.19 103.72,13.04 R6.2 | R9.2 115.44,6.99 115.49,6.99 115.52,7.01 115.52,8.23 114.86,8.89 112.42,8.89 112.04,9.27 111.91,9.4 109.09,9.4 104.14,9.4 102.87,10.67 | v99.31,9.7 101.91,9.7 102.87,10.67
  Top 0.305: IC1.104 55.93,28.14 71.5,12.57 73.15,12.57 76.45,9.27 76.2,9.02 U$4.52
  Bottom 0.254: U$4.52 76.96,8.89 78.36,10.29 84.2,10.29 86.26,8.23 97.84,8.23 v99.31,9.7
DTR/RTS
  Top 0.254: IC3.9 133.86,31.24 133.86,38.61 JP9.8
DTR_I
  Top 0.254: 138.43,34.92 SJ1.2 | 138.43,34.92 SJ1.1 | 138.43,34.92 138.43,32.38 139.06,31.75 139.57,31.24 140.08,31.24 140.35,31.24 IC3.8 143.64,31.11 144.02,31.5 146.3,31.5 147.32,30.48 147.32,25.91 145.92,24.51 X1.4
GND  (via drill 0.51, 1.3)
  Top 0.254: IC1.70 38.93,30.92 v38.73,31.11 | IC1.79 43.43,30.86 v43.18,31.11 | IC1.85 46.43,30.41 v45.72,31.11 | IC1.95 v51.43,31.11 v51.44,31.11 | IC1.53 30.43,30.43 v31.11,31.11 | IC1.52 29.16,31.7 v29.84,32.38 | IC1.37 29.68,39.2 v29.84,39.37 | IC1.27 29.46,44.2 v29.84,43.81 | IC1.17 29.54,49.2 v29.84,48.9 | IC1.10 v29.84,52.7 | IC1.105 56.56,31.7 v56.52,32.38 | IC1.121 56.84,39.7 v56.52,39.37 | IC1.131 56.77,44.7 56.52,44.95 v56.52,45.72 | IC1.141 56.69,49.7 v56.52,49.53 | 61.26,57.2 56.56,57.2 v56.52,57.15 | IC1.208 30.43,57.84 v30.48,57.78 31.24,57.78 31.43,57.97 IC1.206 | IC1.198 35.43,57.91 v35.56,57.78 | IC1.182 43.43,58.17 43.81,57.78 v44.45,57.78 | IC1.188 40.43,57.99 v40.64,57.78 | IC1.173 47.93,58.12 v48.26,57.78
  Top 0.305: U$6.52 12.7,77.6 12.95,77.34 | IC1.10 23.88,52.7 11.81,64.77 U$2.10 | IC1.17 20.52,49.2 13.84,55.88 8.76,55.88 7.49,54.61 U$2.17 | IC1.27 12.58,44.2 11.56,43.18 8.76,43.18 7.62,42.04 U$2.27 | IC1.37 20.4,39.2 11.68,30.48 8.89,30.48 U$2.37 | IC1.52 27.76,31.7 15.11,19.05 15.11,14.73 11.81,11.43 10.29,11.43 10.16,11.3 U$2.52 | IC1.79 43.43,11.05 44.45,10.03 44.45,7.87 45.85,6.48 U$4.27 | IC1.85 46.43,15.67 52.07,10.03 52.07,7.62 U$4.33 53.47,6.22 | IC1.95 51.43,23.25 64.77,9.91 64.77,7.75 66.17,6.35 U$4.43 | U$6.32 38.1,77.34 37.97,77.22 40.43,74.76 IC1.188 | U$6.42 25.15,77.47 35.43,67.19 IC1.198 | IC1.208 30.43,59.74 14.53,75.59 13.54,75.59 12.7,76.43 12.7,77.24 12.75,77.29 12.7,77.34 U$6.52 | U$6.52 12.7,77.37 | U$6.26 45.85,77.47 43.43,75.05 IC1.182 | IC1.173 47.93,68.25 55.88,76.2 56.52,76.2 57.15,76.83 57.15,78.74 U$6.17 | IC1.131 76.61,44.7 78.11,43.2 80.03,43.2 U$5.27 81.43,44.6 | IC1.121 69.01,39.7 78.11,30.61 80.26,30.61 81.41,31.75 U$5.17 | IC1.105 62.03,31.7 69.85,23.88 69.85,18.29 77.98,10.16 80.14,10.16 81.41,11.43 U$5.1 | IC1.141 72.18,49.7 77.34,54.86 77.34,55.12 78.11,55.88 80.14,55.88 81.28,57.02 U$5.37 | IC1.156 61.26,57.2 76.71,72.64 76.71,73.15 78.61,75.06 U$5.52 | IC1.70 38.93,15.31 33.15,9.53 33.15,9.14 32.89,8.89 U$4.18 | IC1.53 30.43,28.52 11.43,9.53 11.43,7.49 12.7,6.22 U$4.1 | U$6.50 15.24,77.34 31.43,61.28 IC1.206
  Top 1.016: v106.05,53.34 U$7.3
  Bottom 0.254: C10.2 29.43,49.31 v29.84,48.9 | C11.2 47.41,58.63 v48.26,57.78 | v38.73,31.11 38.95,30.9 | C4.2 53.55,58.2 v53.98,57.78 | C12.2 56.73,39.59 v56.52,39.37 | C8.2 56.73,35.77 v56.52,35.56 | C6.2 48.05,30.77 v48.39,31.11 | C7.2 35.34,58 v35.56,57.78 | C5.2 29.63,34.08 v29.84,33.66 | C3.2 56.73,54.83 v56.52,54.61 | C2.2 29.63,52.49 v29.84,52.7 | C1.2 34.08,30.9 v34.29,31.11
  Bottom 0.406: C17.2 56.3,49.31 v56.52,49.53 | C18.2 56.3,40.42 v56.52,40.64 | C16.2 54.61,35.56 v56.52,35.56 | C14.2 40.64,56.52 v40.64,57.78 | C13.2 47.84,57.37 v48.26,57.78 | C19.2 45.51,31.33 v45.72,31.11 | C21.2 38.52,31.33 v38.73,31.11 | C20.2 31.54,31.54 v31.11,31.11 | 31.75,39.37 C24.2 | v29.84,39.37 31.75,39.37 | v30.48,40.64 31.11,40.64 31.75,40.01 31.75,39.37 | C23.2 v31.11,50.16 | C22.2 v34.92,34.92
  Bottom 0.813: C15.2 37.05,55.46 v36.83,55.24 | C36.C v36.2,44.45 | v50.16,44.45 C38.C | C39.C v43.18,51.44 | C37.C v43.18,37.47
  other vias: 60.71,59.69 85.34,30.1 15.11,74.3 18.67,19.81 67.31,21.46 22.86,64.77 21.84,23.5 63.88,25.53 74.3,71.75 85.72,71.12 85.09,53.98 85.09,45.09 87,35.56 85.72,12.7 83.19,83.69 93.98,60.96 93.98,53.98 93.98,45.09 93.98,36.2 92.71,24.13 87,59.69 60.2,31.24 85.72,78.11 83.57,65.53 112.9,45.09 105.28,38.73 135.76,23.37 127.38,7.49 120.52,4.06 102.36,71.12 141.1,5.84
  pour Top (isolate 0.305, rank 6): 158.75,85.72 158.75,0 0,0 0,85.72
  pour Bottom (isolate 0.305, rank 6): 158.75,85.72 158.75,0 0,0 0,85.72
  pour Route2: 0,85.72 0,0 158.75,0 158.75,85.72
N$1  (via drill 0.51)
  Top 0.254: LED1.C 106.16,7.1 v104.14,5.08 | Q1.3 118.11,7.62 v116.84,7.62
  Bottom 0.254: v104.14,5.08 105.41,5.08 110.49,5.08 113.03,7.62 v116.84,7.62
N$2
  Top 0.254: 111.25,58.93 111.25,59.18 111.25,59.56 R10.2 112.61,60.96 114.68,60.96 R11.2
  Top 0.406: 111.25,58.93 112.39,57.78 112.39,50.8 111.76,50.16 109.86,50.16 109.63,49.94 U$7.5
N$3
  Top 0.254: R8.1 113.03,5.46 112.89,5.6 LED1.A
N$4
  Top 0.254: R9.1 115.66,5.5 115.7,5.46 115.91,5.25 Q1.1
N$5
  Top 0.254: IC3.2 139.06,23.5 138.43,22.86 138.3,22.73 137.79,22.23 137.79,19.05 138.85,18 C47.1
N$6
  Top 0.254: IC3.6 142.88,28.57 143.51,27.94 143.51,21.59 143.51,20.32 143.09,19.9 C28.1
N$7
  Top 0.254: IC3.1 140.34,22.23 139.7,21.59 138.85,20.74 C25.1
N$8
  Top 0.254: C25.2 140.97,20.32 142.24,21.59 142.24,24.13 141.6,24.77 IC3.3
N$9
  Top 0.254: IC3.4 139.06,26.04 138.43,25.4 138.43,23.75 137.54,22.86 137.29,22.61 137.29,21.84 137.29,18.8 136.27,17.78 135.89,17.78 C26.1
N$10
  Top 0.254: IC3.5 139.57,27.3 137.92,25.65 137.92,24.13 136.65,22.86 136.65,19.81 135.89,19.05 134.62,19.05 133.77,18.2 C26.2
N$11
  Top 0.254: R17.1 143.38,1.27 144.05,1.93 U$10.5
N$13
  Top 0.254: R18.2 152.82,61.05 152.78,61.09 152.65,60.96 LED2.C
N$14
  Top 0.254: JP9.1 140.02,42.86 132.56,42.86 129.86,40.16 129.86,15.88 129.86,15.81 129.79,15.75 129.29,15.24 R22.2
N$15
  Top 0.254: U$10.3 137.29,4.45 137.41,4.32 137.54,4.19 137.58,4.15 R16.1
N$16
  Top 0.254: JP9.3 138.91,41.27 137.79,42.39 132.87,42.39 130.49,40.01 130.49,17.46 130.81,17.14 130.81,14.45 130.81,14.22 130.56,13.97 R12.2
N$17
  Top 0.254: JP9.5 136.4,41.27 135.13,40.01 133.1,40.01 132.97,39.88 131.76,38.67 131.76,27.3 131.76,18.1 132.24,17.62 132.24,12.54 132.24,12.35 132.21,12.32 131.32,11.43 R13.2
N$18
  Top 0.254: JP9.7 132.72,41.27 131.13,39.69 131.13,17.78 131.44,17.46 131.44,13.49 131.44,13.34 130.81,12.7 R23.2
N$19
  Top 0.254: R4.1 129.67,66.8 129.54,66.67 129.41,66.8 128.27,66.8 127.89,67.18 127.85,67.22 R7.2
  Top 0.305: U$8.5 139.29,72.8 139.06,73.03 132.72,73.03 130.81,71.12 130.81,67.31 130.47,66.97 R4.1
N$21
  Route3 0.254: 13.97,76.2 16.51,76.2 16.51,78.74 13.97,78.74 13.97,76.2
N$22
  Route2 0.254: 13.97,76.2 13.97,78.74 16.51,78.74 16.51,76.2 13.97,76.2
PROG_B  (via drill 0.51)
  Top 0.254: v100.33,59.44 94.23,59.44 v93.98,59.69 | R14.1 95.76,13.97 93.98,12.19 S1.4 S1.3 v101.09,12.06
  Top 0.305: IC1.1 27.89,57.2 27.76,57.2 26.04,58.93 v25.91,59.05 19.94,65.02 19.94,65.15 19.94,67.18 10.41,76.71 8.51,76.71 7.75,75.95 7.75,75.06 U$2.1
  Bottom 0.254: v101.09,12.06 101.09,12.57 101.22,12.7 101.22,58.55 v100.33,59.44 | v93.98,59.69 93.22,60.45 93.22,70.61 92.08,71.75 92.08,74.55 91.19,75.44 91.19,76.2 90.68,76.71 88.14,76.71 84.84,73.41 84.84,65.28 83.06,63.5 78.11,63.5 76.83,62.23 31.75,62.23 28.57,59.05 v25.91,59.05
RTS_I
  Top 0.254: SJ1.3 147.96,34.92 151.13,31.75 151.13,30.48 149.86,29.21 149.35,28.7 148.72,28.7 X1.7
RXD  (via drill 0.51)
  Top 0.254: v132.72,35.05 132.33,34.67 132.33,31.11 132.33,30.73 132.33,28.07 133.1,27.3 IC3.12
  Bottom 0.254: JP9.6 136.4,38.73 v132.72,35.05
RXD_I
  Top 0.254: X1.2 145.92,30.1 145.67,29.84 IC3.7
TCK  (via drill 0.51)
  Top 0.254: R1.2 94.4,73.44 v93.34,72.39
  Top 0.305: IC1.158 55.43,60.51 67.31,72.39 71.37,72.39 76.45,77.47 U$6.2
  Bottom 0.254: U$6.2 76.2,78.11 80.01,81.92 84.45,81.92 88.14,78.23 90.93,78.23 91.57,78.87 93.22,78.87 93.98,78.11 93.98,73.03 v93.34,72.39
TCK_IN  (via drill 0.51)
  Top 0.254: R1.1 100.97,73.66 JP10.8 | SL1.3 115.57,79.38 113.67,81.28 v113.03,81.28
  Bottom 0.254: JP10.8 108.58,81.28 v113.03,81.28
TDI  (via drill 0.51)
  Top 0.254: v29.79,61.57 29.92,61.77 29.84,61.85 | R2.2 92.46,76.2 v92.2,75.95
  Top 0.305: IC1.207 30.93,60.76 29.84,61.85 15.49,76.2 14.61,76.2 13.97,76.83 13.97,78.61 12.7,79.88 U$6.51
  Bottom 0.254: v92.2,75.95 90.93,77.22 87.88,77.22 84.33,73.66 84.33,67.82 82.55,66.04 78.11,66.04 77.47,65.41 77.47,64.14 76.2,62.87 31.11,62.87 29.82,61.57 v29.79,61.57
TDI_IN  (via drill 0.51)
  Top 0.254: R2.1 98.42,76.2 v99.69,77.47 JP10.4
  Bottom 0.254: v99.69,77.47 100.33,78.11 118.11,78.11 SL1.5
TDO  (via drill 0.51)
  Top 0.254: v93.34,80.64 93.98,81.28 103.5,81.28 JP10.6 v101.6,76.83
  Top 0.305: IC1.157 55.93,60.25 67.56,71.88 72.52,71.88 77.47,76.83 77.47,78.74 U$6.1
  Bottom 0.254: U$6.1 78.74,82.55 84.45,82.55 88.27,78.74 90.81,78.74 92.08,80.01 92.71,80.01 v93.34,80.64 | v101.6,76.83 102.23,77.47 SL1.4
TMS  (via drill 0.51)
  Top 0.254: 80.14,73.66 80.14,73.79 U$5.51 | v92.2,77.6 92.2,78.11 92.84,78.74 R3.2
  Top 0.305: IC1.155 61.78,56.7 77.47,72.39 77.47,73.03 78.11,73.66 80.14,73.66
  Bottom 0.254: U$5.51 84.84,74.93 87.63,77.72 91.19,77.72 91.31,77.6 v92.2,77.6
TMS_IN  (via drill 0.51)
  Top 0.254: R3.1 v98.42,78.74 JP10.2
  Bottom 0.254: v98.42,78.74 115.57,78.74 119.38,82.55 SL1.6
TXD
  Top 0.254: JP9.4 137.79,37.47 137.16,37.47 136.27,36.58 136.27,30.86 135.89,30.48 135.76,30.35 135.25,29.84 IC3.10
TXD_I  (via drill 0.51)
  Top 0.254: IC3.13 v136.53,26.04
  Bottom 0.254: v136.53,26.04 137.03,26.54 144.65,26.54 145.16,26.54 145.92,27.3 X1.3
VCC1.2_REG
  Top 0.305: R21.2 127.22,32.17 127.13,32.26 127,32.38 126.36,33.02 126.36,34.92 124.46,36.83 115.57,36.83
  Top 0.406: U$14.5 115.34,38.51 113.67,36.83
  Top 0.813: JP6.2 98.55,66.8 101.35,66.8 102.11,66.04 102.11,42.42 102.11,40.13 102.11,39.62 104.78,36.96 104.9,36.83 | U$14.4 117.05,37.67 116.2,36.83 115.57,36.83 113.67,36.83 106.68,36.83 104.9,36.83 | 104.9,36.83 105.41,36.32 C45.1 106.97,30.06 C31.A
VCC2.5_REG  (via drill 0.51)
  Top 0.254: v106.05,59.69 R10.1
  Top 0.305: U$7.4 107.52,51.64 106.68,50.8 106.68,48.9 107.95,47.62 112.39,47.62 115.57,44.45 120.65,44.45 121.92,43.18 121.92,40.01 122.14,40.23 U$14.1
  Top 1.016: JP7.2 100.46,64.14 100.58,64.01 v100.58,60.96 | U$7.4 106.47,51.64 v106.05,52.07 | 127.13,52.07 v127,52.07 127.13,52.07 | 127.13,52.07 129.54,52.07 130.81,53.34 C44.1 | 127.13,52.07 128.4,53.34 C30.A 128.4,56.01 128.4,57.87 R20.2
  Bottom 1.016: v100.58,60.96 104.9,60.96 104.9,60.83 v106.05,59.69 | v106.05,59.69 107.95,57.78 107.95,52.7 107.31,52.07 106.68,52.07 v106.05,52.07 | v106.05,59.69 105.92,59.82
  Bottom 1.27: 107.31,52.07 v127,52.07
  pour Bottom: 102.87,64.52 102.87,64.16 101.8,63.09
VCC3.3  (via drill 0.51)
  Top 0.254: 95.76,61.47 JP8.1 97.28,62.99 97.28,64.77 96.52,65.53 94.74,65.53 93.98,66.29 93.98,69.09 98.04,73.15 101.09,73.15 101.45,73.51 106.17,78.23 108.08,78.23 108.27,78.42 | 108.27,78.42 JP10.10 | SL1.1 111.82,78.04 111.76,78.11 108.58,78.11 108.27,78.42 | C46.2 146.05,4.19 145.8,4.45 U$10.6 142.75,4.45 142.49,4.45 141.35,3.3 v141.39,3.34 R17.2 141.35,1.27 R16.2 | 131.32,5.93 126.07,5.93 125.48,5.33 125.46,5.35 U$9.2 125.41,4.76 v123.19,2.54 | 131.32,5.93 R24.2 | 131.32,5.93 131.32,5.84 v132.08,5.08 | IC3.16 133.86,20.41 C27.1 132.84,19.39 132.84,18.16 132.84,10.16 131.32,8.64 131.32,5.97 131.32,5.93 | R8.2 113.12,7.2 113.16,7.24 114.3,6.1 v114.3,4.45 | C48.2 111.76,69.09 111.37,68.7 U$12.4 109.8,70.92 109.73,70.99 109.73,71 U$12.1
  Top 0.305: 111.82,78.04 111.76,77.98 109.73,75.95 109.73,70.99 | JP3.2 98.42,29.84 109.22,19.05 v109.22,15.24 | R8.2 112.99,7.24 112.9,7.24 110.49,7.24 v109.22,8.51
  Bottom 0.254: v141.39,3.34 139.65,5.08 v132.08,5.08 | v123.19,2.54 119.13,2.54 117.73,3.94 114.81,3.94 v114.3,4.45
  Bottom 0.305: v109.22,8.51 v109.22,15.24
  Bottom 0.635: JP3.2 JP2.2 JP4.2 JP5.2 98.42,58.8 95.76,61.47
  Bottom 0.813: 95.76,61.47 JP8.1
VCC3.3_REG  (via drill 0.51)
  Top 0.254: R4.2 129.67,69.47 129.54,69.6 129.29,69.85 R19.2 127.85,70.27 v126.36,71.75 128.4,73.79 C29.A 128.52,75.05 128.52,75.06 128.52,75.56 128.4,75.69 128.4,76.92 C43.1
  Top 0.813: U$8.4 137.59,71.55 v137.79,71.75
  Top 1.778: v103.63,66.04 104.14,66.55 121.79,66.55 v121.92,66.67
  Bottom 1.016: v103.63,66.04 99.31,61.72 98.55,61.72 JP8.2
  Bottom 1.778: v137.79,71.75 137.79,65.41 136.53,64.14 123.19,64.14 121.92,65.41 v121.92,66.67 121.92,67.31 v126.36,71.75
VCCAUX  (via drill 0.51, 1.3)
  Top 0.254: IC1.149 56.88,53.7 v56.52,53.34 | IC1.195 36.93,58.32 v37.47,57.78 | IC1.166 51.43,58.42 v52.07,57.78 | IC1.66 36.93,30.38 v36.2,31.11 | IC1.92 49.93,30.84 v49.66,31.11 | IC1.111 56.92,34.7 v56.52,34.29 | IC1.44 29.35,35.7 v29.84,36.2 | IC1.7 29.62,54.2 v29.84,53.98 | R15.2 121.92,7.24 119.76,9.4 116.48,9.4 112.83,9.4 112.22,10.01 104.29,10.01 103.63,10.67 103.63,12.19 104.65,13.21 104.65,14.99 104.39,15.24 102.36,15.24 100.97,15.24 v100.2,14.48 100.71,13.97 R6.1
  Top 0.305: IC1.7 24.67,54.2 15.62,63.25 15.62,64.77 11.81,68.58 8.76,68.58 7.49,67.31 U$2.7 | IC1.44 25.41,35.7 11.3,21.59 U$2.44 10.03,21.72 | 27.81,8.76 U$4.14 27.94,9.4 36.93,18.39 IC1.66 | IC1.92 49.93,21.19 61.09,10.03 61.09,9.14 60.96,9.02 U$4.40 | 27.81,80.14 U$6.39 29.08,78.87 29.08,76.83 29.84,76.07 30.48,76.07 36.93,69.62 IC1.195 | U$6.10 66.04,77.34 51.43,62.73 IC1.166 | IC1.111 64.36,34.7 73.66,25.4 73.66,22.23 78.11,17.78 80.01,17.78 U$5.7 81.41,19.18 | IC1.149 66.53,53.7 77.47,64.64 77.47,65.41 78.11,66.04 80.01,66.04 U$5.45 | R14.2 99.69,13.97 v100.2,14.48 | R5.2 92.71,64.39 92.96,64.14 JP7.1
  Top 0.61: C33.A 27.84,59.16 29.46,57.53 29.46,56.9 29.84,56.52 v30.48,56.52 | C32.A 57.89,29.11 v55.24,31.75
  Bottom 0.254: C4.1 51.85,58 v52.07,57.78 | C8.1 56.73,34.08 v56.52,34.29 | C6.1 49.74,30.9 v49.66,31.11 | C7.1 37.05,58.2 v37.47,57.78 | C5.1 29.63,35.77 v29.84,36.2 | C3.1 56.73,53.12 v56.52,53.34 | C2.1 29.63,54.19 v29.84,53.98 | v100.2,14.48 100.2,15.11 100.58,15.49 100.58,57.66 97.28,60.96 97.28,62.74 JP7.1
  Bottom 0.406: C1.1 35.77,30.7 v36.2,31.11
  other vias: 87,67.31 52.32,55.88 53.34,54.86 54.36,53.85 53.59,56.64 55.12,55.12
  pour Bottom: 29.21,55.88 31.75,58.42 54.61,58.42 57.15,55.88 57.15,33.02 54.61,30.48 31.75,30.48 29.21,33.02 29.21,43.18 30.48,43.18 30.48,44.45 29.21,44.45
  pour Route3: 97.03,65.91 93.85,65.91 90.68,69.09 64.52,69.09 58.67,63.25 58.67,57.66 57.66,56.64 51.82,56.64 51.31,56.13 51.31,55.88 54.36,52.83 60.2,52.83 61.98,54.61 61.98,60.45 67.06,65.53 90.68,65.53 93.85,62.36 97.03,62.36
VCCINT  (via drill 0.51, 1.3)
  Top 0.254: IC1.13 29.45,51.2 v29.84,50.8 | IC1.170 49.43,57.88 v49.53,57.78 | IC1.117 56.75,37.7 v56.52,38.1 | IC1.67 37.43,31.08 v37.47,31.11
  Top 0.305: IC1.13 22.59,51.2 12.83,60.96 8.76,60.96 7.49,59.69 U$2.13 | U$6.14 61.09,77.34 49.43,65.69 IC1.170 | IC1.117 66.31,37.7 77.47,26.54 77.47,26.04 78.11,25.4 80.01,25.4 U$5.13 81.41,26.8 | IC1.67 37.43,17.87 29.21,9.65 29.21,7.49 30.48,6.22 U$4.15
  Top 0.61: v57.15,58.42 C35.A | C34.A v29.21,30.48
  Bottom 0.254: C10.1 27.94,51.44 28.57,50.8 v29.84,50.8 | C11.1 49.11,58.2 v49.53,57.78 | C12.1 56.94,37.88 v56.52,38.1
  Bottom 0.406: C9.1 37.25,30.9 v37.47,31.11
  other vias: 87,64.14
  pour Route3 (rank 6): 0,85.72 158.75,85.72 158.75,0 0,0
VCCO0  (via drill 0.51, 1.3)
  Top 0.254: IC1.201 33.93,58.15 v34.29,57.78 | IC1.191 38.93,58.23 v39.37,57.78 | IC1.176 46.43,57.86 v46.35,57.78
  Top 0.305: U$6.20 53.34,77.34 46.43,70.43 IC1.176 | IC1.191 38.93,72.19 34.29,76.83 34.29,78.87 33.02,80.14 U$6.35 | IC1.201 33.93,65.26 22.99,76.2 22.23,76.2 21.59,76.83 21.59,78.74 U$6.45
  Bottom 0.406: C14.1 39.37,56.52 v39.37,57.78 | v46.35,57.78 46.14,57.57
  Bottom 0.635: 87,50.16 84.45,50.16 83.82,50.8 83.82,59.69 | 87,50.16 v87,52.07 | 40.01,60.96 34.29,60.96 33.66,60.33 33.66,58.42 v34.29,57.78 34.29,57.15 34.92,56.52 | v39.37,57.78 39.37,60.33 40.01,60.96 | 40.01,60.96 43.18,60.96 | 43.18,60.96 46.35,60.96 | 46.35,60.96 45.72,60.33 45.72,58.42 v46.35,57.78 | 46.35,60.96 82.55,60.96 | 46.14,57.57 C13.1 | 43.18,60.96 C39.A | 87,50.16 92.08,50.16 93.34,48.9 JP5.1
  Bottom 0.813: 82.55,60.96 83.82,59.69 | C15.1 34.92,56.52
VCCO1  (via drill 0.51, 1.3)
  Top 0.254: IC1.143 56.62,50.7 v56.52,50.8 | IC1.125 56.73,41.7 v56.52,41.91 | 57.92,36.2 57.15,36.2 v56.52,36.83
  Top 0.305: U$5.10 78.61,21.59 75.44,24.77 75.44,26.04 65.27,36.2 IC1.114 57.92,36.2 57.91,36.2 | IC1.125 71.97,41.7 78.11,35.56 80.01,35.56 U$5.21 81.41,36.96 | IC1.143 70.39,50.7 78.11,58.42 80.14,58.42 81.41,59.69 U$5.39
  Bottom 0.406: 59.69,42.55 59.69,37.47 59.05,36.83 v56.52,36.83 54.61,36.83 C16.1 | C17.1 56.3,51.02 v56.52,50.8 | C18.1 56.3,42.12 v56.52,41.91
  Bottom 0.635: 87,48.9 84.45,48.9 83.82,48.26 60.33,48.26 | 87,48.9 v87,46.99 | 60.33,48.26 59.69,48.9 59.69,50.16 59.05,50.8 v56.52,50.8 | 60.33,48.26 59.69,47.62 59.69,44.45 | 59.69,44.45 59.69,42.55 59.05,41.91 v56.52,41.91 | 59.69,44.45 C38.A | 87,48.9 91.44,48.9 93.98,46.35 JP4.1
VCCO2  (via drill 0.51, 1.3)
  Top 0.305: IC1.59 33.43,23.78 19.05,9.4 19.05,7.62 U$4.7 | 38.23,6.35 38.35,6.22 | 38.23,6.35 U$4.21 | 38.23,6.35 36.83,7.75 36.83,9.53 40.43,13.12 IC1.73 40.43,30.69 v40.01,31.11 | 56.01,8.76 U$4.36 55.88,10.03 47.93,17.98 IC1.88 47.93,30.43 47.24,31.11 v46.99,31.11 | 33.4,29.59 33.41,29.6 IC1.59 | IC1.59 33.43,30.7 v33.02,31.11
  Bottom 0.406: C19.1 47.2,31.33 v46.99,31.11 | C21.1 40.22,31.33 v40.01,31.11 | C20.1 33.23,31.33 v33.02,31.11
  Bottom 0.61: 40.64,30.48 v40.01,31.11 | v33.02,31.11 33.02,27.94 33.66,27.3
  Bottom 0.635: 87,41.27 84.45,41.27 83.82,40.64 83.82,34.29 82.55,33.02 59.69,33.02 59.05,32.38 59.05,29.21 57.15,27.3 47.62,27.3 | 87,41.27 91.44,41.27 93.98,43.81 JP2.1 | 87,41.27 v87,43.18 | 33.66,27.3 41.27,27.3 | 41.27,27.3 44.45,27.3 | 44.45,27.3 47.62,27.3 | v46.99,31.11 46.99,27.94 47.62,27.3 | 40.64,30.48 40.64,27.94 41.27,27.3 | 44.45,27.3 44.45,31.5
  Bottom 0.813: C37.A 43.31,32.64 44.45,31.5
VCCO3  (via drill 0.51, 1.3)
  Top 0.254: IC1.21 28.96,47.24
  Top 0.305: U$2.21 7.62,49.4 9.02,50.8 15.11,50.8 18.71,47.2 IC1.21 29.64,47.2 v29.84,46.99 | 10.03,29.08 U$2.38 10.29,29.34 11.81,29.34 21.17,38.7 IC1.38 29.25,38.7 v29.84,38.1 | U$2.46 10.29,19.05 25.94,34.7 IC1.46 28.42,34.7 28.45,34.67 29.59,34.67 v29.84,34.92
  Top 0.61: v29.84,38.1 29.84,37.94 30.96,36.83 30.96,35.4 30.64,35.08 30,35.08 v29.84,34.92
  Bottom 0.406: 31.75,34.92 C22.1 v29.84,34.92 | C24.1 31.75,38.1 v29.84,38.1 | C23.1 31.11,46.99 v29.84,46.99
  Bottom 0.635: JP3.1 93.34,41.27 92.08,40.01 87,40.01 | 87,40.01 85.72,40.01 85.09,39.37 85.09,32.38 83.19,30.48 60.96,30.48 60.33,29.84 60.33,28.57 57.78,26.04 31.11,26.04 26.04,30.86 26.04,37.47 | 87,40.01 v87,38.1 | 26.04,37.47 26.04,45.09 | 26.04,45.09 26.04,45.72 27.3,46.99 v29.84,46.99 | v29.84,38.1 26.67,38.1 26.04,37.47 | 26.04,45.09 31.37,45.09
  Bottom 0.813: 31.37,45.09 C36.A
VIN5.0
  Top 0.254: J1.PWR 146.05,67.31 146.05,62.75 LED2.A
  Top 0.813: 132.08,64.52 132.08,64.14 132.49,64.55 U$8.1 | 133.99,64.52 133.99,64.14 134.19,64.34 U$8.2
  Top 1.016: 103.63,57.15 104.14,57.15 104.55,56.74 U$7.1 | 103.63,55.24 104.14,55.24 104.34,55.04 U$7.2 | U$14.2 120.44,42.75 120.02,43.18 115.57,43.18 | 115.57,43.18 114.94,43.18 | C40.A | C40.A 103.63,49.91 | C40.A 107.82,44.58 109.22,43.18 | 109.22,43.18 114.3,43.18 115.57,43.18 | C42.A 111.89,40.51 109.22,43.18
  Top 1.676: 143.51,74.93 C41.A
  Top 1.778: 103.63,49.91 103.63,54.61 103.63,55.12 103.63,55.24 103.63,57.15 103.63,62.99 104.9,64.52 132.08,64.52 133.99,64.52 139.45,64.52 143.26,64.52 146.05,67.31 | 146.05,67.31 J1.PWR 146.05,67.31 | 143.51,74.93 143.51,69.85 146.05,67.31

## Text on the board
Bottom: 05/12/2009
tPlace: GND | TDO | 208/7 | 206/5 | 204/3 | 202/1 | 200/9 | 198/7 | 196/5 | 194/3 | 192/1 | 190/9 | 188/7 | 186/5 | 184/3 | 182/1 | 180/9 | 178/7 | 176/5 | 174/3 | 172/1 | 170/9 | 168/7 | 166/5 | 164/3 | 162/1 | 160/9 | 158/7 | TDI | TMS | 1/2 | 156/5 | TMS | TDI | TDO | TCK | VCC | TCK | 3/4 | BANK 0 | 154/3 | GND | 5/6 | 152/1 | VCC | 7/8 | 150/9 | 1.2V REG | 9/0 | 148/7 | 2.5V REG | 11/2 | 146/5 | 3.3V REG | 5.0V ONLY | 13/4 | 144/3 | 15/6 | 142/1 | 17/8 | 140/9 | 19/0 | 138/7 | 21/2 | BANK 3 | 136/5 | VCCO0 | 23/4 | 134/3 | VCCO1 | 25/6 | 132/1 | VCCO2 | DTR/RTS-PD | RXD-PD | TXD-FD | CTS-FD | 27/8 | 130/9 | VCCO3 | FPGA | BANK 1 | 29/0 | 128/7 | 3.3V | SHIFT | 31/2 | 126/5 | 33/4 | 124/3 | 35/6 | 122/1 | 37/8 | 120/9 | 39/0 | 118/7 | 41/2 | 116/5 | M0 | 43/4 | 114/3 | M1 | S3E Eval Card | 45/6 | 112/1 | M2 | 47/8 | 110/9 | 49/0 | 108/7 | 51/2 | BANK 2 | 106/5 | M/Ser | M/SPI | M/BPI | S/Par | S/Ser | JTAG | RESET | DONE | 53/4 | 55/6 | 57/8 | 59/0 | 61/2 | 63/4 | 65/6 | 67/8 | 69/0 | 71/2 | 73/4 | 75/6 | 77/8 | 79/0 | 81/2 | 83/4 | 85/6 | 87/8 | 89/0 | 91/2 | 93/4 | 95/6 | 97/8 | 99/0 | 101/2 | 103/4
bPlace: V_AUX | V_INT | GND | V_O0 | V_O1 | V_O2 | V_O3